# EAGLE schematic MainLogger (EAGLE 9.6.2)

## Sheet 1 of 6
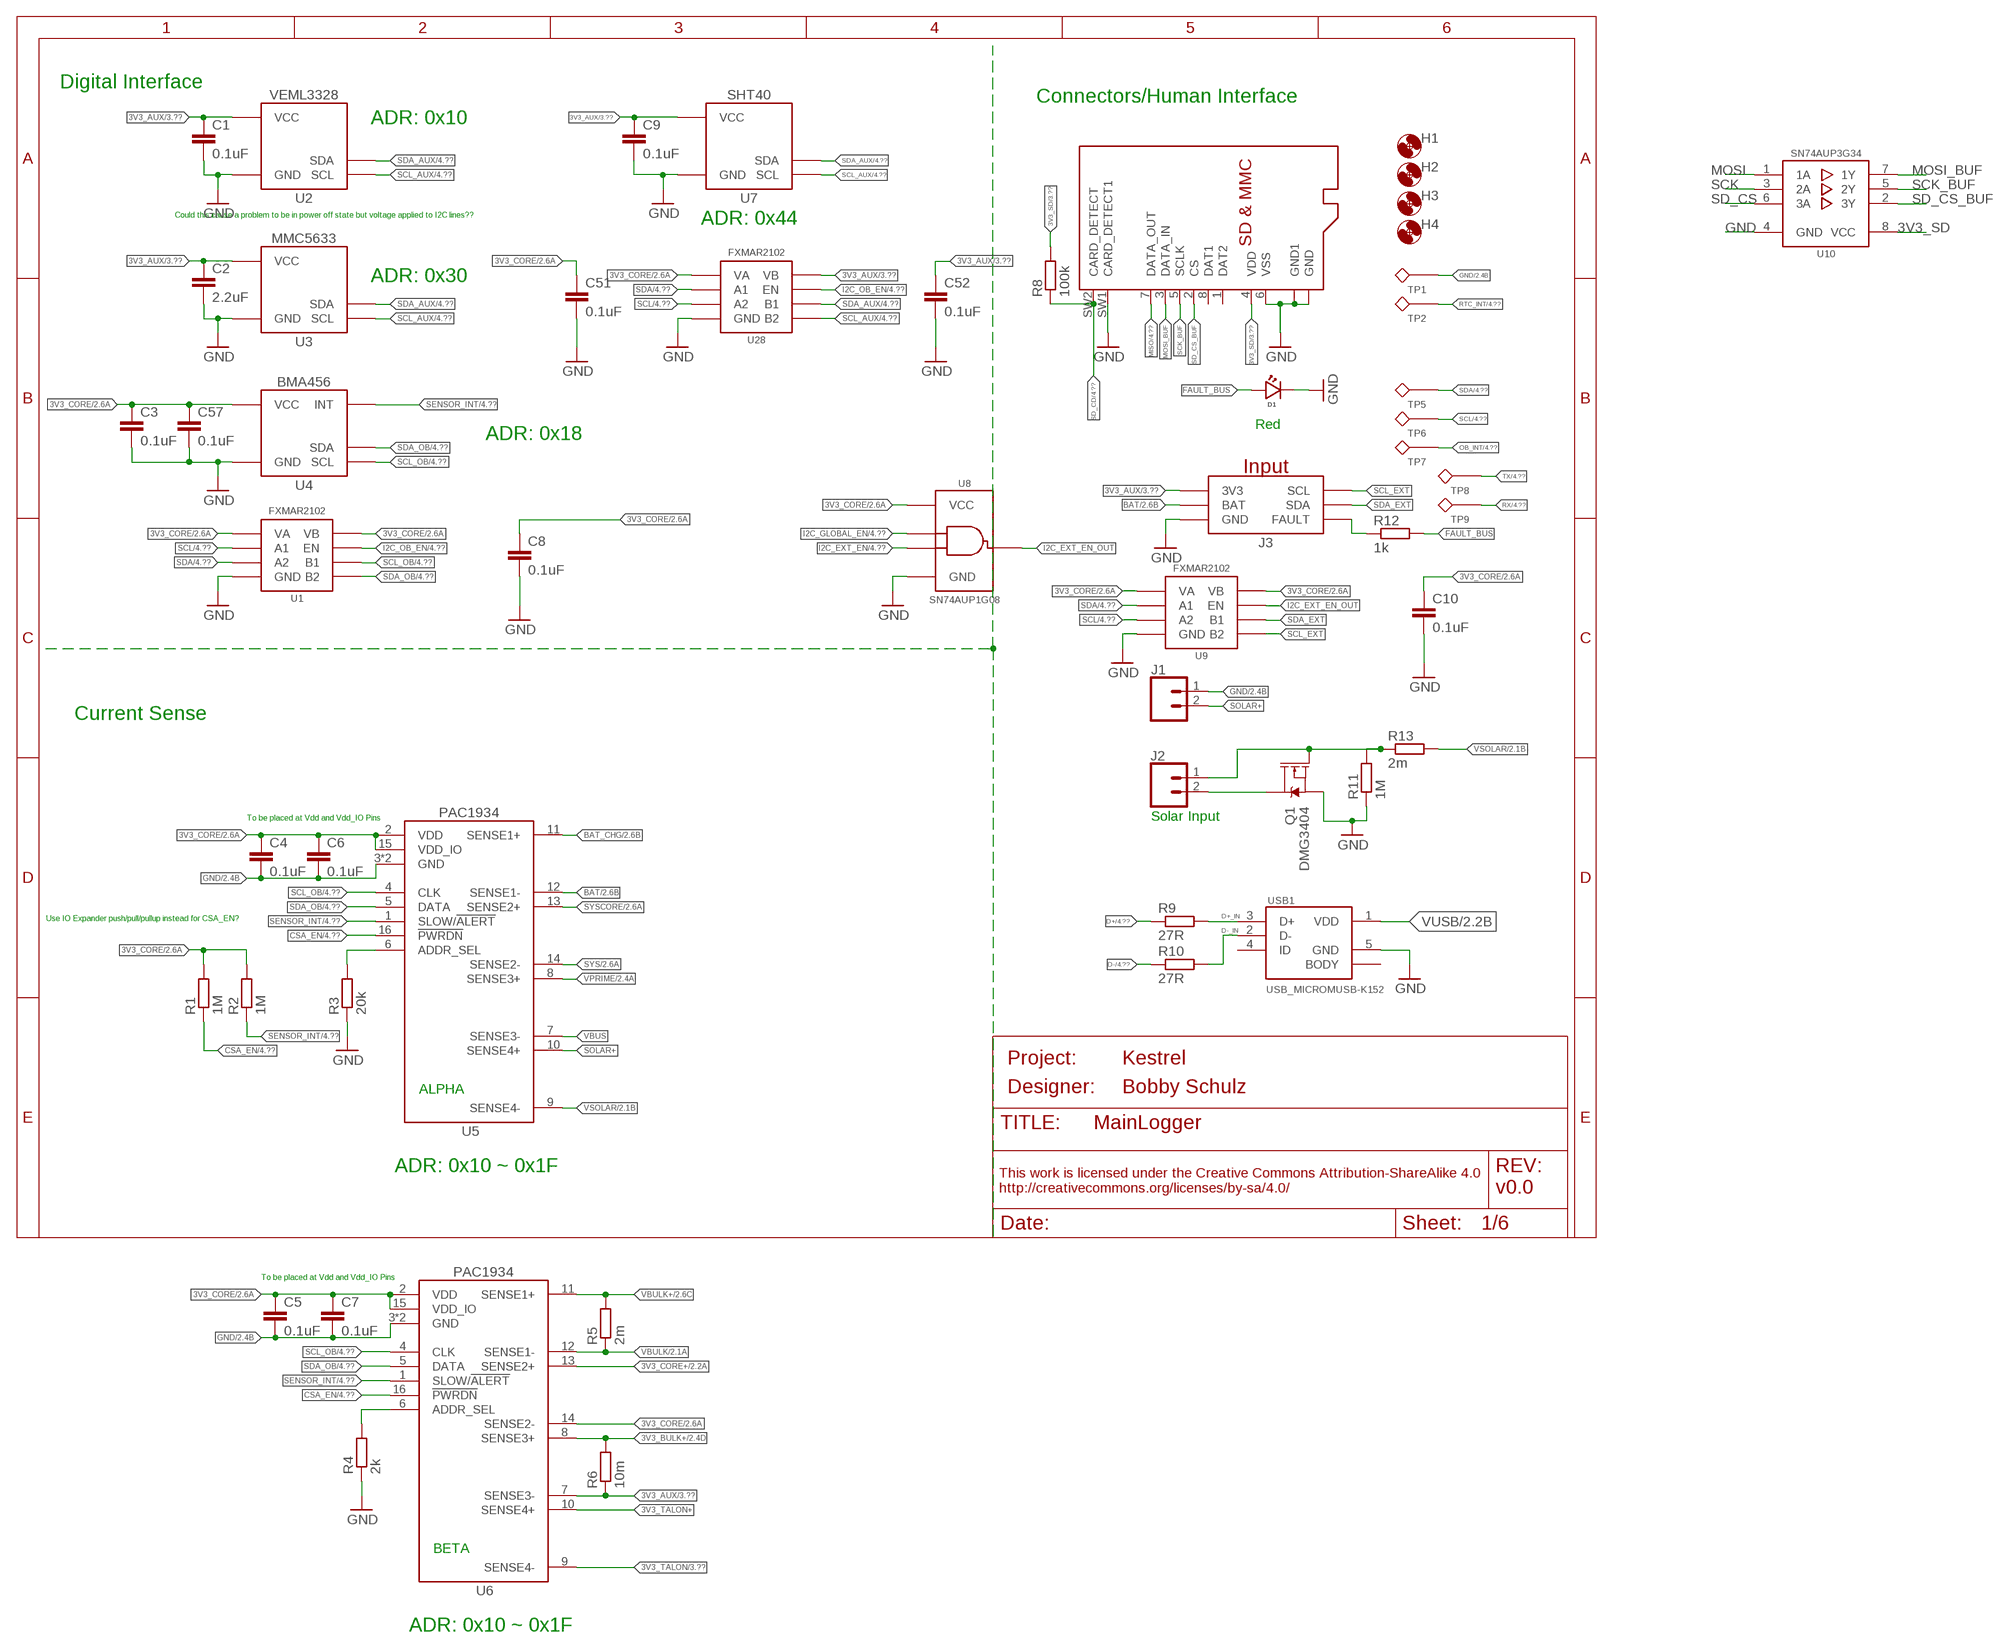
[diagram p0: schematic, sheet 1]
FRAME1 (FRAME_A_L): DESIGNER: Bobby Schulz; PROJECT: Kestrel; REV: v0.0

### Parts
C1  0.1uF  C-EU0.1UFC0402  [C0402]
C2  2.2uF  C-EU2.2UFC0603  [C0603]
C3  0.1uF  C-EU0.1UFC0402  [C0402]
C4  0.1uF  C-EU0.1UFC0402  [C0402]
C5  0.1uF  C-EU0.1UFC0402  [C0402]
C6  0.1uF  C-EU0.1UFC0402  [C0402]
C7  0.1uF  C-EU0.1UFC0402  [C0402]
C8  0.1uF  C-EU0.1UFC0402  [C0402]
C9  0.1uF  C-EU0.1UFC0402  [C0402]
C10  0.1uF  C-EU0.1UFC0402  [C0402]
C51  0.1uF  C-EU0.1UFC0402  [C0402]
C52  0.1uF  C-EU0.1UFC0402  [C0402]
C57  0.1uF  C-EU0.1UFC0402  [C0402]
D1  LEDRED0603  [LED_0603]
H1  MOUNTING_HOLE4_NP  [4_40]
H2  MOUNTING_HOLE4_NP  [4_40]
H3  MOUNTING_HOLE4_NP  [4_40]
H4  MOUNTING_HOLE4_NP  [4_40]
J1  CONN_02-JST-2MM-SMT  [JST-2-SMD]
J2  CONN_023.5MM_ROUND_RESTRICT  [SCREWTERMINAL-3.5MM-2_ROUND_RESTRICT]
J3  GEMS_POWER_PLUGINPUT_RT  [2X3_MICROFIT_RT]
Q1  DMG3404  MOSFET-NCH-DMG3404L  [SOT23-3]
R1  1M  R-EU_1MR0402  [R0402]
R2  1M  R-EU_1MR0402  [R0402]
R3  20k  R-EU_20KR0402  [R0402]
R4  2k  R-EU_2KR0402  [R0402]
R5  2m  R-EU_0.002R0805  [R0805]
R6  10m  R-EU_0.01R0805  [R0805]
R8  100k  R-EU_100KR0402  [R0402]
R9  27R  R-EU_27R0402  [R0402]
R10  27R  R-EU_27R0402  [R0402]
R11  1M  R-EU_1MR0402  [R0402]
R12  1k  R-EU_1KR0402  [R0402]
R13  2m  R-EU_0.002R0805  [R0805]
SD1  MICROSDMOLEX_503182  [MICROSD_MOLEX_5031821852]
TP1  TESTPOINT_DNP_RCU  [TESTPOINT_0603]
TP2  TESTPOINT_DNP_RCU  [TESTPOINT_0603]
TP5  TESTPOINT_DNP_RCU  [TESTPOINT_0603]
TP6  TESTPOINT_DNP_RCU  [TESTPOINT_0603]
TP7  TESTPOINT_DNP_RCU  [TESTPOINT_0603]
TP8  TESTPOINT_DNP_RCU  [TESTPOINT_0603]
TP9  TESTPOINT_DNP_RCU  [TESTPOINT_0603]
U1  FXMAR2102UMLP  [UQFN-8_1.4X1.2]
U2  VEML3328  [VEML6075]
U3  MMC5633  [BGA_4]
U4  BMA456  [LGA-12_2X2]
U5  PAC1934QFN  [QFN16]
U6  PAC1934QFN  [QFN16]
U7  SHT40  [SHT4X]
U8  SN74AUP1G08DCK  [DCK_R-PDSO-G5]
U9  FXMAR2102UMLP  [UQFN-8_1.4X1.2]
U10  SN74AUP3G34DCU  [DCU_(R-PDSO-G8)]
U28  FXMAR2102UMLP  [UQFN-8_1.4X1.2]
USB1  USB_MICROMUSB-K152  [MUSB-K152-30]

### Nets
3V3_AUX [Dummy]: C1.1 C2.1 C9.1 C52.1 J3.5(3V3) R6.1 U2.4(VCC) U3.B1(VCC) U6.7(SENSE3-) U7.3(VCC) U28.8(VB) ; also sheet 3,4
3V3_BULK+: R6.2 U6.8(SENSE3+) ; also sheet 2,3
3V3_CORE: C3.1 C4.1 C5.1 C6.1 C7.1 C8.1 C10.1 C51.1 C57.1 R1.2 R2.2 U1.1(VA) U1.8(VB) U4.3(VCC) U4.7(VCC) U4.10(VCC) U5.2(VDD) U5.15(VDD_IO) U6.2(VDD) U6.14(SENSE2-) U6.15(VDD_IO) U8.5(VCC) U9.1(VA) U9.8(VB) U28.1(VA) ; also sheet 2,3,4,5
3V3_CORE+: U6.13(SENSE2+) ; also sheet 2
3V3_SD: R8.2 SD1.4(VDD) U10.8(VCC) ; also sheet 3
3V3_TALON: U6.9(SENSE4-) ; also sheet 3,6
3V3_TALON+: U6.10(SENSE4+) ; also sheet 3
BAT: J3.1(BAT) U5.12(SENSE1-) ; also sheet 2
BAT_CHG: U5.11(SENSE1+) ; also sheet 2
CSA_EN: R1.1 U5.16(!PWRDN) U6.16(!PWRDN) ; also sheet 4
D+: R9.1 ; also sheet 4
D+_IN: R9.2 USB1.3(D+) ; also sheet 3
D-: R10.1 ; also sheet 4
D-_IN: R10.2 USB1.2(D-) ; also sheet 3
FAULT_BUS: D1.ANODE R12.2
GND: C1.2 C2.2 C3.2 C4.2 C5.2 C6.2 C7.2 C8.2 C9.2 C10.2 C51.2 C52.2 C57.2 D1.CATHODE J1.1 J3.2(GND) Q1.2(S) R3.1 R4.1 R11.1 SD1.6(VSS) SD1.BODY@1(GND1) SD1.BODY@2(GND1) SD1.BODY@3(GND) SD1.BODY@4(GND) SD1.BODY@5(GND1) SD1.SW1(CARD_DETECT1) TP1.1 U1.4(GND) U2.1(GND) U3.A1(GND) U4.1(GND) U4.8(GND) U4.9(GND) U5.3(GND) U5.EP(GND) U6.3(GND) U6.EP(GND) U7.4(GND) U8.3(GND) U9.4(GND) U10.4(GND) U28.4(GND) USB1.5(GND) ; also sheet 2,3,4,5,6
I2C_EXT_EN: U8.2(B) ; also sheet 4
I2C_EXT_EN_OUT: U8.4(Y) U9.5(EN)
I2C_GLOBAL_EN: U8.1(A) ; also sheet 4,6
I2C_OB_EN: U1.5(EN) U28.5(EN) ; also sheet 4
MISO: SD1.7(DATA_OUT) ; also sheet 4
MOSI: U10.1(1A) ; also sheet 4
MOSI_BUF: SD1.3(DATA_IN) U10.7(1Y)
N$1: R3.2 U5.6(ADDR_SEL)
N$17: R4.2 U6.6(ADDR_SEL)
N$25: J3.3(FAULT) R12.1
OB_INT: TP7.1 ; also sheet 4
RTC_INT: TP2.1 ; also sheet 4
RX: TP9.1 ; also sheet 4,6
SCK: U10.3(2A) ; also sheet 4
SCK_BUF: SD1.5(SCLK) U10.5(2Y)
SCL: TP6.1 U1.2(A1) U9.3(A2) U28.3(A2) ; also sheet 4,6
SCL_AUX: U2.3(SCL) U3.A2(SCL) U7.2(SCL) U28.6(B2) ; also sheet 4
SCL_EXT: J3.6(SCL) U9.6(B2)
SCL_OB: U1.7(B1) U4.12(SCL) U5.4(CLK) U6.4(CLK) ; also sheet 4,5
SD_CD: R8.1 SD1.SW2(CARD_DETECT) ; also sheet 4
SD_CS: U10.6(3A) ; also sheet 4
SD_CS_BUF: SD1.2(CS) U10.2(3Y)
SDA: TP5.1 U1.3(A2) U9.2(A1) U28.2(A1) ; also sheet 4,6
SDA_AUX: U2.2(SDA) U3.B2(SDA) U7.1(SDA) U28.7(B1) ; also sheet 4
SDA_EXT: J3.4(SDA) U9.7(B1)
SDA_OB: U1.6(B2) U4.2(SDA) U5.5(DATA) U6.5(DATA) ; also sheet 4,5
SENSOR_INT: R2.1 U4.5(INT) U5.1(SLOW/!ALERT) U6.1(SLOW/!ALERT) ; also sheet 4
SOLAR+: J1.2 J2.1 Q1.1(G) R11.2 R13.1 U5.10(SENSE4+)
SOLAR-: J2.2 Q1.3(D)
SYS: U5.14(SENSE2-) ; also sheet 2
SYSCORE: U5.13(SENSE2+) ; also sheet 2,4
TX: TP8.1 ; also sheet 4,6
VBULK: R5.1 U6.12(SENSE1-) ; also sheet 2,4
VBULK+: R5.2 U6.11(SENSE1+) ; also sheet 2
VBUS: U5.7(SENSE3-) ; also sheet 2
VPRIME: U5.8(SENSE3+) ; also sheet 2
VSOLAR: R13.2 U5.9(SENSE4-) ; also sheet 2
VUSB: USB1.1(VDD) ; also sheet 2,3,4
Unconnected: SD1.1(DAT2) SD1.8(DAT1) USB1.4(ID) USB1.BODY@1(BODY) USB1.BODY@2(BODY) USB1.BODY@3(BODY) USB1.BODY@4(BODY)

### Notes on the sheet
- Digital Interface
- Connectors/Human Interface
- ADR: 0x10
- Could this cause a problem to be in power off state but voltage applied to I2C lines?? | ADR: 0x44
- ADR: 0x30
- Red
- ADR: 0x18
- Current Sense
- To be placed at Vdd and Vdd_IO Pins | Solar Input
- Use IO Expander push/pull/pullup instead for CSA_EN?
- ALPHA
- ADR: 0x10 ~ 0x1F
- To be placed at Vdd and Vdd_IO Pins
- BETA
- ADR: 0x10 ~ 0x1F

## Sheet 2 of 6
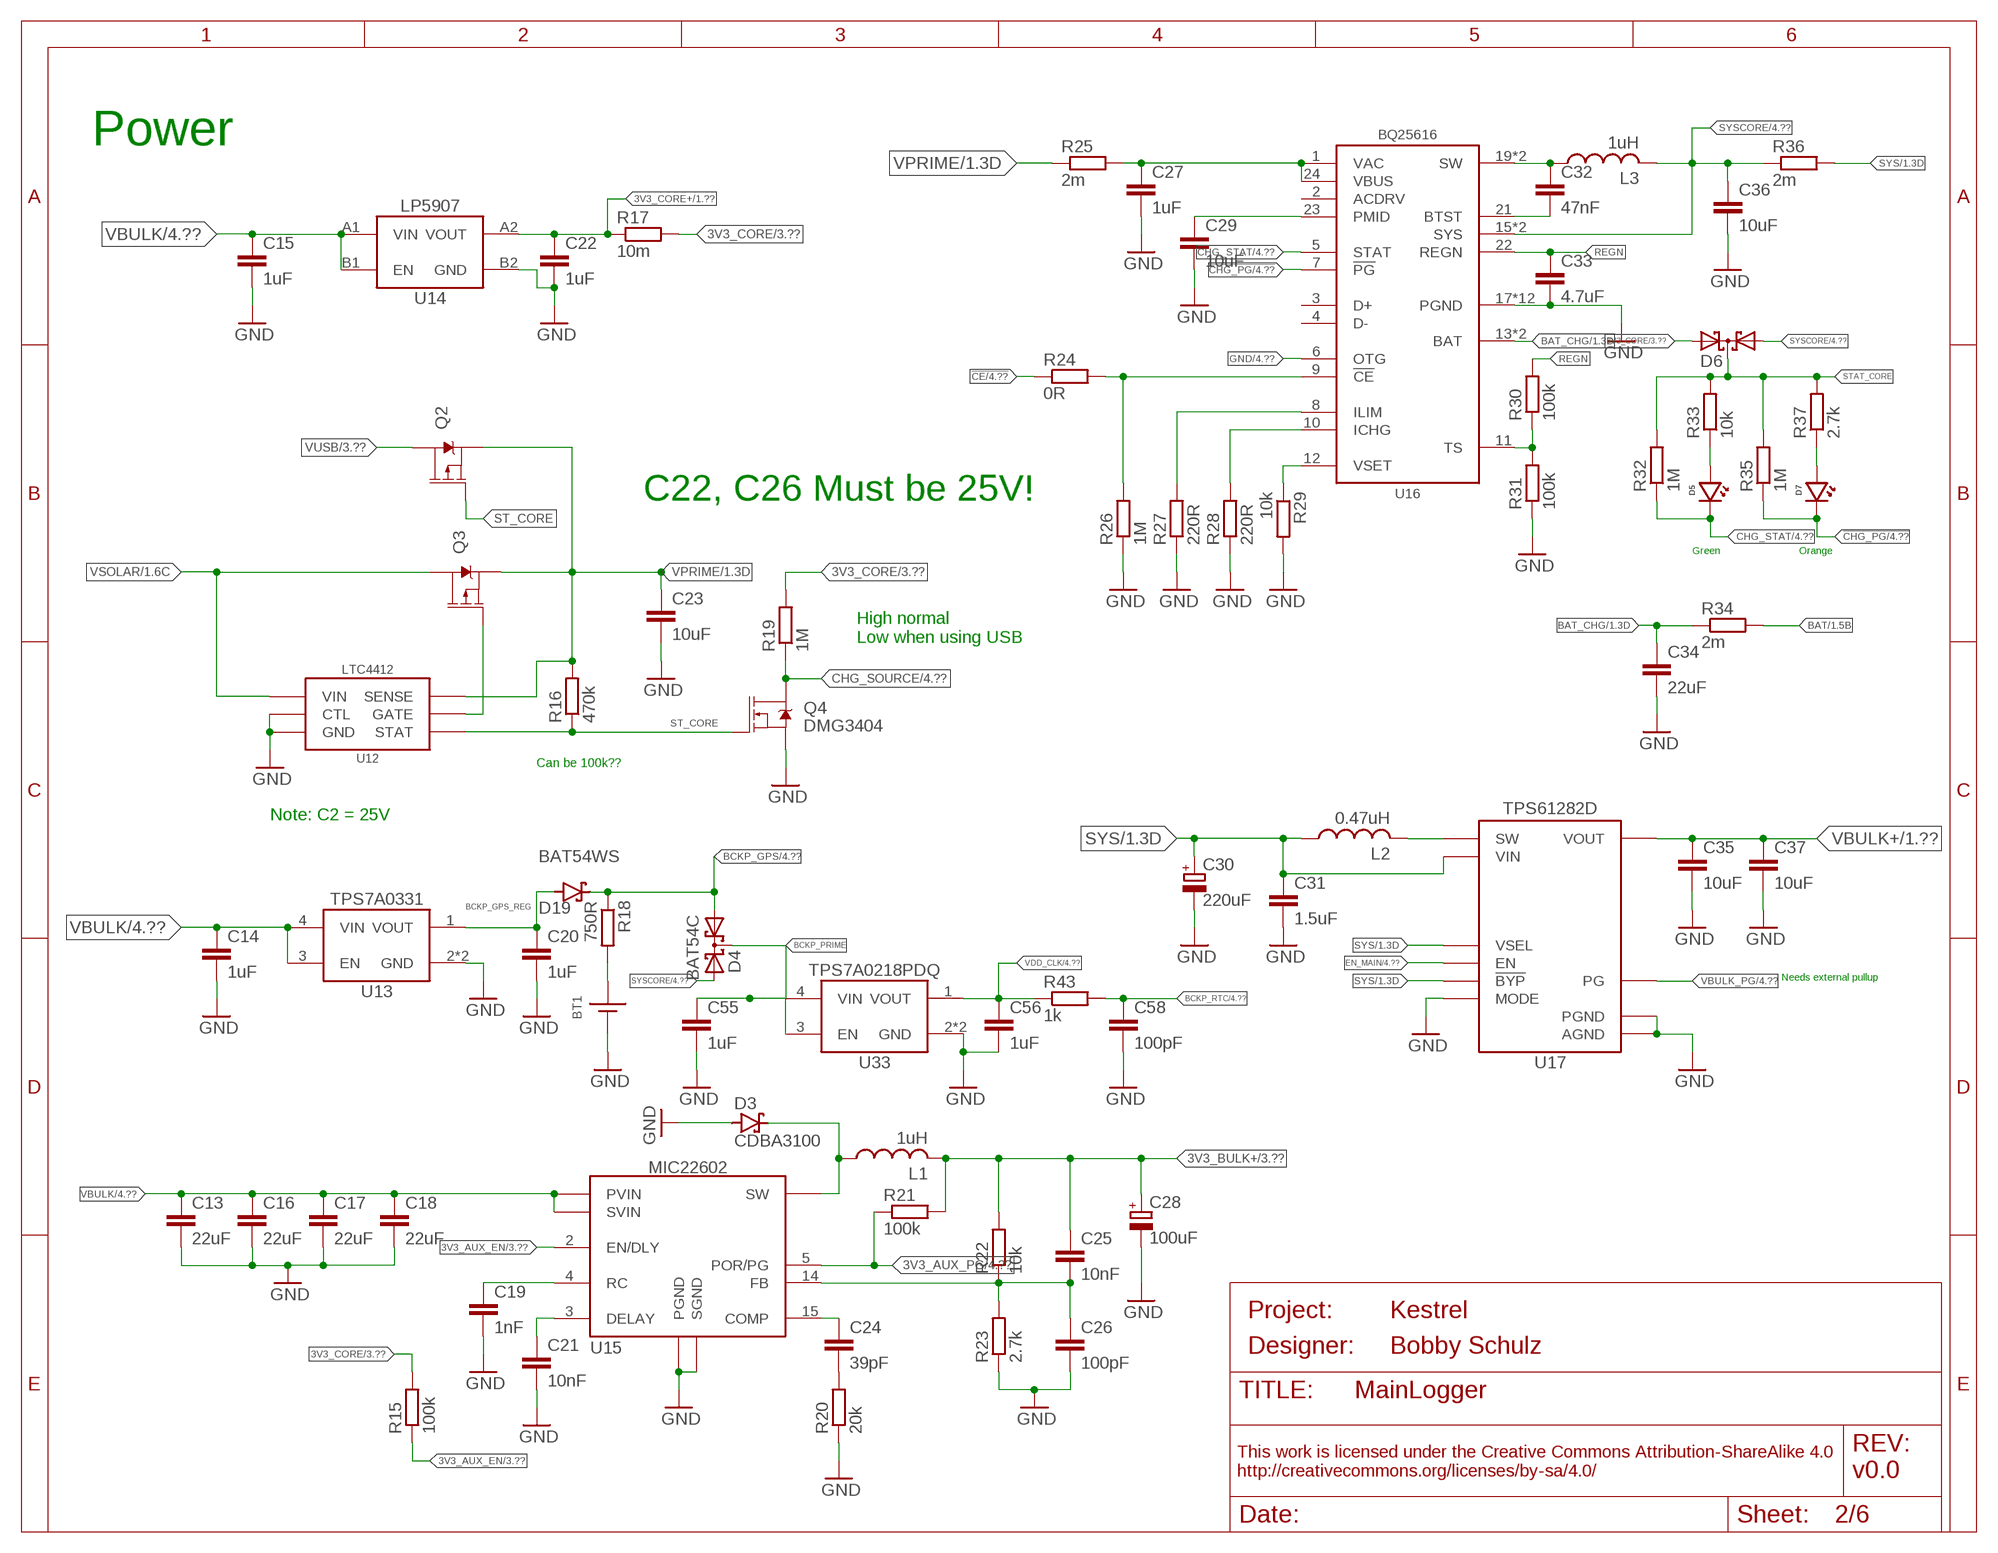
[diagram p1: schematic, sheet 2]
FRAME2 (FRAME_A_L): DESIGNER: Bobby Schulz; PROJECT: Kestrel; REV: v0.0

### Parts
BT1  BATTERY_COINML621  [ML621S]
C13  22uF  C-EU22UFC0805  [C0805]
C14  1uF  C-EU1UFC0603  [C0603]
C15  1uF  C-EU1UFC0603  [C0603]
C16  22uF  C-EU22UFC0805  [C0805]
C17  22uF  C-EU22UFC0805  [C0805]
C18  22uF  C-EU22UFC0805  [C0805]
C19  1nF  C-EU1NFC0402  [C0402]
C20  1uF  C-EU1UFC0603  [C0603]
C21  10nF  C-EU10NFC0402  [C0402]
C22  1uF  C-EU1UFC0603  [C0603]
C23  10uF  C-EU10UFC0805  [C0805]
C24  39pF  C-EU39PFC0402  [C0402]
C25  10nF  C-EU10NFC0402  [C0402]
C26  100pF  C-EU100PFC0402  [C0402]
C27  1uF  C-EU1UFC0603  [C0603]
C28  100uF  CTANT_EU1411  [C1411_TANT]
C29  10uF  C-EU10UFC0805  [C0805]
C30  220uF  CTANT_EU2917  [C2917]
C31  1.5uF  C-EU1.5UFC0805  [C0805]
C32  47nF  C-EU47NFC0402  [C0402]
C33  4.7uF  C-EU4.7UFC0805  [C0805]
C34  22uF  C-EU22UFC0805  [C0805]
C35  10uF  C-EU10UFC0805  [C0805]
C36  10uF  C-EU10UFC0805  [C0805]
C37  10uF  C-EU10UFC0805  [C0805]
C55  1uF  C-EU1UFC0603  [C0603]
C56  1uF  C-EU1UFC0603  [C0603]
C58  100pF  C-EU100PFC0402  [C0402]
D3  CDBA3100  DIODE_SCHOTTKYDO-214AC  [DO214AC]
D4  BAT54C  DIODE_CCBAT54CSOT23  [SOT23-3]
D5  LEDGREEN0603  [LED_0603]
D6  DIODE_CCBAT54CSOT23  [SOT23-3]
D7  LEDYELLOW0603  [LED_0603]
D19  BAT54WS  DIODE_SCHOTTKYSOD-323  [SOD323-R]
L1  1uH  INDUCTOR_MAIA_4.1X4.1  [WE-MAIA(4.1X4.1)]
L2  0.47uH  INDUCTOR_MAPI_4.1X4.1  [WE-MAPI(4.1X4.1)]
L3  1uH  INDUCTOR_MAIA_4.1X4.1  [WE-MAIA(4.1X4.1)]
Q2  MOSFET_PCH-DMP3036SFG  [POWERDI3333-8]
Q3  MOSFET_PCH-DMP3036SFG  [POWERDI3333-8]
Q4  DMG3404  MOSFET-NCH-DMG3404L  [SOT23-3]
R15  100k  R-EU_100KR0402  [R0402]
R16  470k  R-EU_470KR0603  [R0603]
R17  10m  R-EU_0.01R0805  [R0805]
R18  750R  R-EU_750R0603  [R0603]
R19  1M  R-EU_1MR0402  [R0402]
R20  20k  R-EU_20KR0402  [R0402]
R21  100k  R-EU_100KR0402  [R0402]
R22  10k  R-EU_10KR0402  [R0402]
R23  2.7k  R-EU_2.7KR0402  [R0402]
R24  0R  R-EU_0.0R0402  [R0402]
R25  2m  R-EU_0.002R0805  [R0805]
R26  1M  R-EU_1MR0402  [R0402]
R27  220R  R-EU_220R0402  [R0402]
R28  220R  R-EU_220R0402  [R0402]
R29  10k  R-EU_10KR0402  [R0402]
R30  100k  R-EU_100KR0402  [R0402]
R31  100k  R-EU_100KR0402  [R0402]
R32  1M  R-EU_1MR0402  [R0402]
R33  10k  R-EU_10KR0402  [R0402]
R34  2m  R-EU_0.002R0805  [R0805]
R35  1M  R-EU_1MR0402  [R0402]
R36  2m  R-EU_0.002R0805  [R0805]
R37  2.7k  R-EU_2.7KR0402  [R0402]
R43  1k  R-EU_1KR0402  [R0402]
U12  LTC4412S6  [SOT23-6L]
U13  TPS7A0331PDQ  [X2SON]
U14  LP59073.3VYKE  [YKE0004]
U15  MIC22602  [QFN24_POWER]
U16  BQ25616  [QFN24_POWER]
U17  TPS61282D  [YFP0016]
U33  TPS7A0218PDQ  [X2SON]

### Nets
3V3_AUX_EN: R15.1 U15.2(EN/DLY) ; also sheet 3,4
3V3_AUX_PG: R21.1 U15.5(POR/PG) ; also sheet 4
3V3_BULK+: C25.1 C28.ANODE(+) L1.P$2 R21.2 R22.2 ; also sheet 1,3
3V3_CORE: D6.2(A2) R15.2 R17.2 R19.2 ; also sheet 1,3,4,5
3V3_CORE+: C22.1 R17.1 U14.A2(VOUT) ; also sheet 1
!CE: R24.1 ; also sheet 4
!CHG_PG: D7.CATHODE R35.1 U16.7(!PG) ; also sheet 4
BAT: R34.2 ; also sheet 1
BAT_CHG: C34.1 R34.1 U16.13(BAT) U16.14(BAT) ; also sheet 1
BCKP_GPS: D4.1(A1) D19.C R18.1 ; also sheet 4
BCKP_GPS_REG: C20.1 D19.A U13.1(VOUT)
BCKP_PRIME: C55.1 D4.3(C) U33.3(EN) U33.4(VIN)
BCKP_RTC: C58.1 R43.2 ; also sheet 4
BTST: C32.2 U16.21(BTST)
CHG_SOURCE: Q4.3(D) R19.1 ; also sheet 4
CHG_STAT: D5.CATHODE R32.1 U16.5(STAT) ; also sheet 4
COMP: C24.1 U15.15(COMP)
DELAY: C21.1 U15.3(DELAY)
EN_MAIN: U17.A1(EN) ; also sheet 4
FB: C25.2 C26.1 R22.1 R23.2 U15.14(FB)
GND: BT1.- C13.2 C14.2 C15.2 C16.2 C17.2 C18.2 C19.2 C20.2 C21.2 C22.2 C23.2 C26.2 C27.2 C28.CATHODE(-) C29.2 C30.- C31.2 C33.2 C34.2 C35.2 C36.2 C37.2 C55.2 C56.2 C58.2 D3.A Q4.2(S) R20.1 R23.1 R26.1 R27.1 R28.1 R29.2 R31.1 U12.2(GND) U12.3(CTL) U13.2(GND) U13.EP(GND) U14.B2(GND) U15.7(PGND) U15.12(PGND) U15.16(SGND) U15.19(PGND) U15.24(PGND) U15.EP(PGND) U15.EP@1(PGND) U15.EP@2(PGND) U15.EP@3(PGND) U15.EP@4(PGND) U15.EP@5(PGND) U15.EP@6(PGND) U15.EP@7(PGND) U15.EP@8(PGND) U15.EP@9(PGND) U16.6(OTG) U16.17(PGND) U16.18(PGND) U16.EP(PGND) U16.EP@1(PGND) U16.EP@2(PGND) U16.EP@3(PGND) U16.EP@4(PGND) U16.EP@5(PGND) U16.EP@6(PGND) U16.EP@7(PGND) U16.EP@8(PGND) U16.EP@9(PGND) U17.B2(MODE) U17.C2(AGND) U17.D1(AGND) U17.D2(PGND) U17.D3(PGND) U17.D4(PGND) U33.2(GND) U33.EP(GND) ; also sheet 1,3,4,5,6
ICHG: R28.2 U16.10(ICHG)
ILIM: R27.2 U16.8(ILIM)
N$5: Q3.4(G) U12.5(GATE)
N$7: BT1.+ R18.2
N$10: R24.2 R26.2 U16.9(!CE)
N$18: D7.ANODE R37.1
N$20: D5.ANODE R33.1
N$33: C24.2 R20.2
PMID: C29.1 U16.23(PMID)
RC: C19.1 U15.4(RC)
REGN: C33.1 R30.2 U16.22(REGN)
ST_CORE: Q2.4(G) Q4.1(G) R16.1 U12.4(STAT)
STAT_CORE: D6.3(C) R32.2 R33.2 R35.2 R37.2
SW: C32.1 L3.P$1 U16.19(SW) U16.20(SW)
SW1: D3.C L1.P$1 U15.8(SW) U15.9(SW) U15.10(SW) U15.11(SW) U15.20(SW) U15.21(SW) U15.22(SW) U15.23(SW)
SW2: L2.P$2 U17.C3(SW) U17.C4(SW)
SYS: C30.+ C31.1 L2.P$1 R36.2 U17.A3(VIN) U17.A4(VIN) U17.B1(VSEL) U17.C1(!BYP) ; also sheet 1
SYSCORE: C36.1 D4.2(A2) D6.1(A1) L3.P$2 R36.1 U16.15(SYS) U16.16(SYS) ; also sheet 1,4
TS: R30.1 R31.2 U16.11(TS)
VBULK: C13.1 C14.1 C15.1 C16.1 C17.1 C18.1 U13.3(EN) U13.4(VIN) U14.A1(VIN) U14.B1(EN) U15.1(PVIN) U15.6(PVIN) U15.13(PVIN) U15.17(SVIN) U15.18(PVIN) ; also sheet 1,4
VBULK+: C35.1 C37.1 U17.B3(VOUT) U17.B4(VOUT) ; also sheet 1
VBULK_PG: U17.A2(PG) ; also sheet 4
VBUS: C27.1 R25.2 U16.1(VAC) U16.24(VBUS) ; also sheet 1
VDD_CLK: C56.1 R43.1 U33.1(VOUT) ; also sheet 4
VPRIME: C23.1 Q2.1(S) Q2.2(S) Q2.3(S) Q3.1(S) Q3.2(S) Q3.3(S) R16.2 R25.1 U12.6(SENSE) ; also sheet 1
VSET: R29.1 U16.12(VSET)
VSOLAR: Q3.EP@1(D) Q3.EP@2(D) Q3.EP@3(D) Q3.EP@4(D) Q3.EP@5(D) U12.1(VIN) ; also sheet 1
VUSB: Q2.EP@1(D) Q2.EP@2(D) Q2.EP@3(D) Q2.EP@4(D) Q2.EP@5(D) ; also sheet 1,3,4
Unconnected: U16.2(ACDRV) U16.3(D+) U16.4(D-)

### Notes on the sheet
- Power
- C22, C26 Must be 25V!
- Green | Orange
- High normal
  Low when using USB
- Can be 100k??
- Note: C2 = 25V
- Needs external pullup

## Sheet 3 of 6
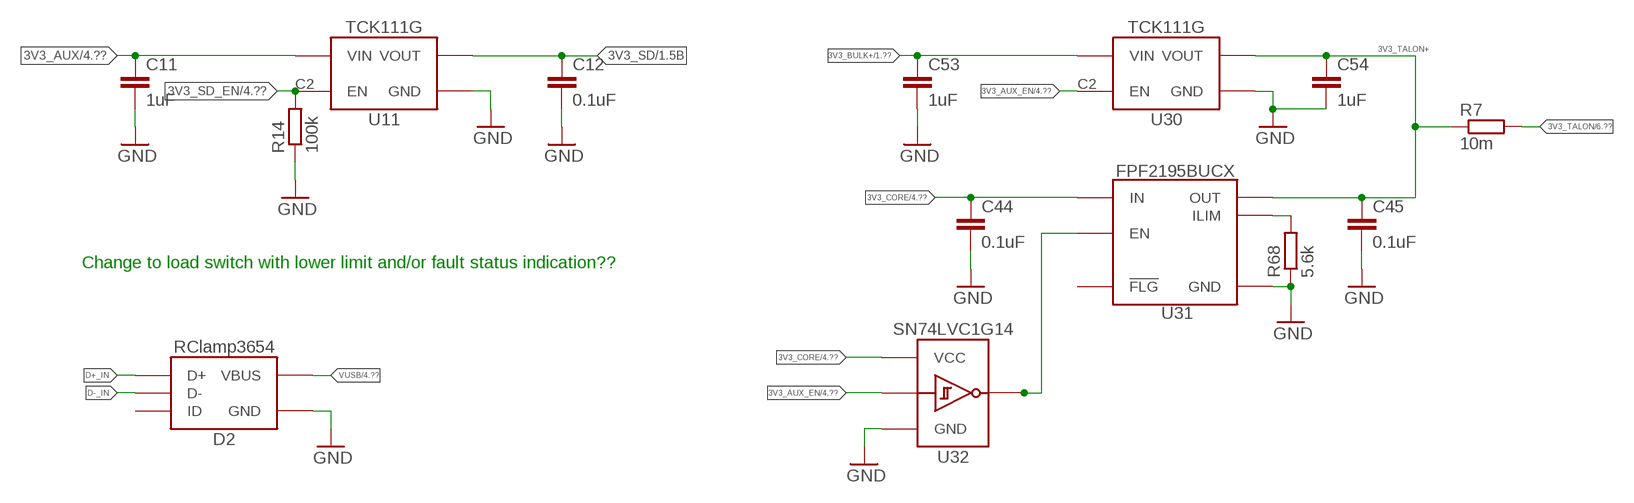
[diagram p2: schematic, sheet 3]

### Parts
C11  1uF  C-EU1UFC0603  [C0603]
C12  0.1uF  C-EU0.1UFC0402  [C0402]
C44  0.1uF  C-EU0.1UFC0402  [C0402]
C45  0.1uF  C-EU0.1UFC0402  [C0402]
C53  1uF  C-EU1UFC0603  [C0603]
C54  1uF  C-EU1UFC0603  [C0603]
D2  RCLAMP3654  [DFN_6_1.6X1.6]
R7  10m  R-EU_0.01R0805  [R0805]
R14  100k  R-EU_100KR0402  [R0402]
R68  5.6k  R-EU_5.6KR0402  [R0402]
U11  TCK111G  [WCSP_6]
U30  TCK111G  [WCSP_6]
U31  FPF2195BUCX  [WCSP_6]
U32  SN74LVC1G14DCK  [DCK_R-PDSO-G5]

### Nets
3V3_AUX [Dummy]: C11.1 U11.A2(VIN) U11.B2(VIN) ; also sheet 1,4
3V3_AUX_EN: U30.C2(EN) U32.2(A) ; also sheet 2,4
3V3_BULK+: C53.1 U30.A2(VIN) U30.B2(VIN) ; also sheet 1,2
3V3_CORE: C44.1 U31.B2(IN) U32.5(VCC) ; also sheet 1,2,4,5
3V3_SD: C12.1 U11.A1(VOUT) U11.B1(VOUT) ; also sheet 1
3V3_SD_EN: R14.2 U11.C2(EN) ; also sheet 4
3V3_TALON: R7.2 ; also sheet 1,6
3V3_TALON+: C45.1 C54.1 R7.1 U30.A1(VOUT) U30.B1(VOUT) U31.B1(OUT) ; also sheet 1
D+_IN: D2.2(D+) ; also sheet 1
D-_IN: D2.1(D-) ; also sheet 1
GND: C11.2 C12.2 C44.2 C45.2 C53.2 C54.2 D2.EP(GND) R14.1 R68.1 U11.C1(GND) U30.C1(GND) U31.C2(GND) U32.3(GND) ; also sheet 1,2,4,5,6
N$19: R68.2 U31.C1(ILIM)
N$28: U31.A2(EN) U32.4(Y)
VUSB: D2.6(VBUS) ; also sheet 1,2,4
Unconnected: D2.3(ID) U31.A1(!FLG)

### Notes on the sheet
- Change to load switch with lower limit and/or fault status indication??

## Sheet 4 of 6
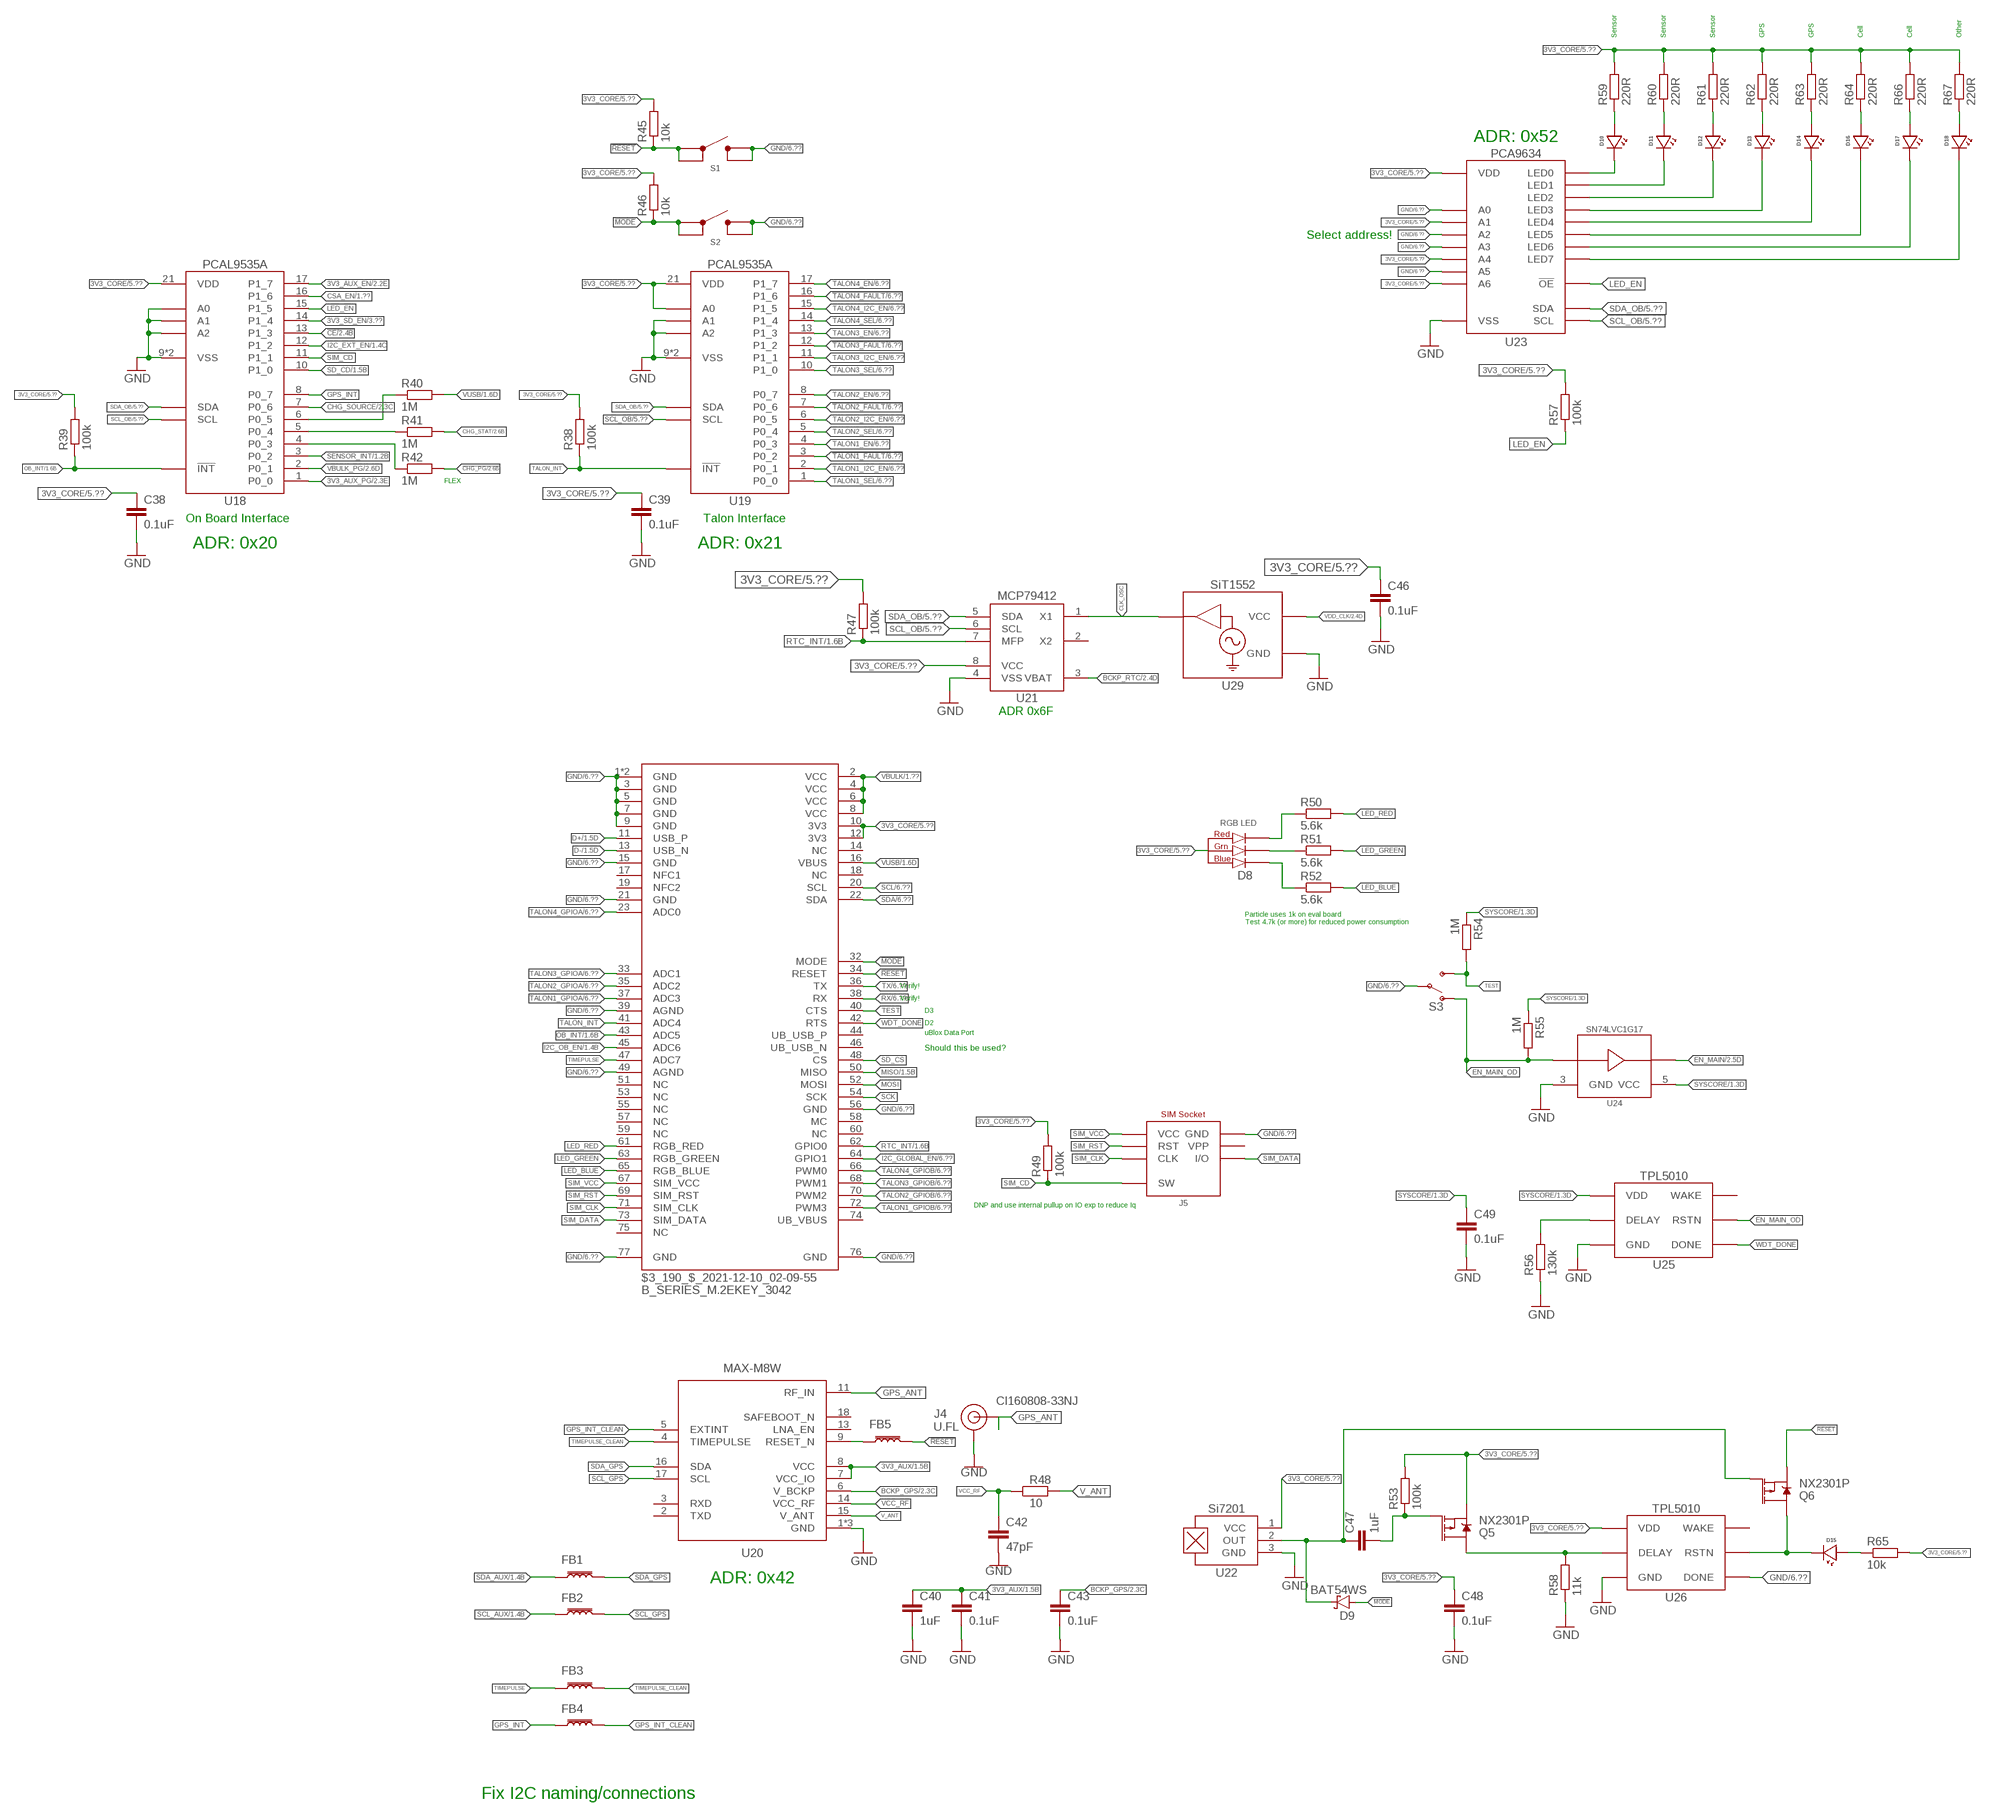
[diagram p3: schematic, sheet 4]

### Parts
$3_190_$_2021-12-10_02-09-55  B_SERIES_M.2EKEY_3042  [PARTICLE_M.2EKEY]
C38  0.1uF  C-EU0.1UFC0402  [C0402]
C39  0.1uF  C-EU0.1UFC0402  [C0402]
C40  1uF  C-EU1UFC0603  [C0603]
C41  0.1uF  C-EU0.1UFC0402  [C0402]
C42  47pF  C-EU47PFC0402  [C0402]
C43  0.1uF  C-EU0.1UFC0402  [C0402]
C46  0.1uF  C-EU0.1UFC0402  [C0402]
C47  1uF  C-EU1UFC0603  [C0603]
C48  0.1uF  C-EU0.1UFC0402  [C0402]
C49  0.1uF  C-EU0.1UFC0402  [C0402]
D8  CLVBA-FKA  [CLVBA-FKA]
D9  BAT54WS  DIODE_SCHOTTKYSOD-323  [SOD323-R]
D10  LEDGREEN0603  [LED_0603]
D11  LEDYELLOW0603  [LED_0603]
D12  LEDRED0603  [LED_0603]
D13  LEDGREEN0603  [LED_0603]
D14  LEDYELLOW0603  [LED_0603]
D15  LEDGREEN0603  [LED_0603]
D16  LEDGREEN0603  [LED_0603]
D17  LEDYELLOW0603  [LED_0603]
D18  LEDRED0603  [LED_0603]
FB1  FERRITE_BEAD1KS0402  [R0402]
FB2  FERRITE_BEAD1KS0402  [R0402]
FB3  FERRITE_BEAD1KS0402  [R0402]
FB4  FERRITE_BEAD1KS0402  [R0402]
FB5  FERRITE_BEAD1KS0402  [R0402]
J4  U.FL  U.FL2PIN  [U.FL]
J5  SIM_CDNANO_SF72  [SIM_SF72]
Q5  NX2301P  MOSFET-PCH-NX2301P  [SOT23-3]
Q6  NX2301P  MOSFET-PCH-NX2301P  [SOT23-3]
R38  100k  R-EU_100KR0402  [R0402]
R39  100k  R-EU_100KR0402  [R0402]
R40  1M  R-EU_1MR0402  [R0402]
R41  1M  R-EU_1MR0402  [R0402]
R42  1M  R-EU_1MR0402  [R0402]
R45  10k  R-EU_10KR0402  [R0402]
R46  10k  R-EU_10KR0402  [R0402]
R47  100k  R-EU_100KR0402  [R0402]
R48  10  R-EU_10R0402  [R0402]
R49  100k  R-EU_100KR0402  [R0402]
R50  5.6k  R-EU_5.6KR0402  [R0402]
R51  5.6k  R-EU_5.6KR0402  [R0402]
R52  5.6k  R-EU_5.6KR0402  [R0402]
R53  100k  R-EU_100KR0402  [R0402]
R54  1M  R-EU_1MR0402  [R0402]
R55  1M  R-EU_1MR0402  [R0402]
R56  130k  R-EU_130KR0402  [R0402]
R57  100k  R-EU_100KR0402  [R0402]
R58  11k  R-EU_11KR0402  [R0402]
R59  220R  R-EU_220R0402  [R0402]
R60  220R  R-EU_220R0402  [R0402]
R61  220R  R-EU_220R0402  [R0402]
R62  220R  R-EU_220R0402  [R0402]
R63  220R  R-EU_220R0402  [R0402]
R64  220R  R-EU_220R0402  [R0402]
R65  10k  R-EU_10KR0402  [R0402]
R66  220R  R-EU_220R0402  [R0402]
R67  220R  R-EU_220R0402  [R0402]
S1  BUTTON4.2X3.2  [SWITCH_4.2X3.2]
S2  BUTTON4.2X3.2  [SWITCH_4.2X3.2]
S3  SPDT7103K2CWAV2  [7103K2CWAV2]
U18  PCAL9535AQFN  [QFN24]
U19  PCAL9535AQFN  [QFN24]
U20  MAX-M8W  [MAX-M8]
U21  MCP79412SOIC  [SO08]
U22  HALL_EFFECT_SI7201  [SOT23-3]
U23  PCA9634QFN  [QFN20_5X5]
U24  SN74LVC1G17DCK  [DCK_R-PDSO-G5]
U25  TPL5010DDC  [DDC_R-PDSO-G6]
U26  TPL5010DDC  [DDC_R-PDSO-G6]
U29  SIT1552  [LD-4]

### Nets
3V3_AUX [Dummy]: C40.1 C41.1 U20.7(VCC_IO) U20.8(VCC) ; also sheet 1,3
3V3_AUX_EN: U18.17(P1_7) ; also sheet 2,3
3V3_AUX_PG: U18.1(P0_0) ; also sheet 2
3V3_CORE: $3_190_$_2021-12-10_02-09-55.10(3V3) $3_190_$_2021-12-10_02-09-55.12(3V3) C38.1 C39.1 C46.1 C48.1 D8.2(ANODE) Q5.2(S) R38.2 R39.2 R45.2 R46.2 R47.2 R49.2 R53.2 R57.2 R59.2 R60.2 R61.2 R62.2 R63.2 R64.2 R65.2 R66.2 R67.2 U18.21(VDD) U19.18(A0) U19.21(VDD) U21.8(VCC) U22.1(VCC) U23.3(A4) U23.15(A6) U23.18(VDD) U23.20(A1) U26.1(VDD) ; also sheet 1,2,3,5
3V3_SD_EN: U18.14(P1_4) ; also sheet 3
!CE: U18.13(P1_3) ; also sheet 2
!CHG_PG: R42.2 ; also sheet 2
!MODE: $3_190_$_2021-12-10_02-09-55.32(MODE) D9.A R46.1 S2.1 S2.2
!RESET: $3_190_$_2021-12-10_02-09-55.34(RESET) FB5.2 Q6.2(S) R45.1 S1.1 S1.2
!TALON1_FAULT: U19.3(P0_2) ; also sheet 6
!TALON2_FAULT: U19.7(P0_6) ; also sheet 6
!TALON3_FAULT: U19.12(P1_2) ; also sheet 6
!TALON4_FAULT: U19.16(P1_6) ; also sheet 6
BCKP_GPS: C43.1 U20.6(V_BCKP) ; also sheet 2
BCKP_RTC: U21.3(VBAT) ; also sheet 2
CHG_SOURCE: U18.7(P0_6) ; also sheet 2
CHG_STAT: R41.2 ; also sheet 2
CLK_OSC: U21.1(X1) U29.2(CLK)
CSA_EN: U18.16(P1_6) ; also sheet 1
D+: $3_190_$_2021-12-10_02-09-55.11(USB_P) ; also sheet 1
D-: $3_190_$_2021-12-10_02-09-55.13(USB_N) ; also sheet 1
EN_MAIN: U24.4(Y) ; also sheet 2
EN_MAIN_OD: R55.2 S3.1(O) U24.2(A) U25.6(RSTN)
GND: $3_190_$_2021-12-10_02-09-55.1(GND) $3_190_$_2021-12-10_02-09-55.3(GND) $3_190_$_2021-12-10_02-09-55.5(GND) $3_190_$_2021-12-10_02-09-55.7(GND) $3_190_$_2021-12-10_02-09-55.9(GND) $3_190_$_2021-12-10_02-09-55.15(GND) $3_190_$_2021-12-10_02-09-55.21(GND) $3_190_$_2021-12-10_02-09-55.39(AGND) $3_190_$_2021-12-10_02-09-55.49(AGND) $3_190_$_2021-12-10_02-09-55.56(GND) $3_190_$_2021-12-10_02-09-55.76(GND) $3_190_$_2021-12-10_02-09-55.77(GND) $3_190_$_2021-12-10_02-09-55.GND C38.2 C39.2 C40.2 C41.2 C42.2 C43.2 C46.2 C48.2 C49.2 J4.1(GND) J4.2(GND) J5.5(GND) J5.CSW(GND) J5.GND@1(GND) J5.GND@2(GND) J5.GND@3(GND) J5.GND@4(GND) J5.GND@5(GND) J5.GND@6(GND) J5.GND@7(GND) J5.GND@8(GND) J5.GND@9(GND) J5.GND@10(GND) R56.1 R58.1 S1.3 S1.4 S2.3 S2.4 S3.2(P) U18.9(VSS) U18.18(A0) U18.23(A1) U18.24(A2) U18.EP(VSS) U19.9(VSS) U19.23(A1) U19.24(A2) U19.EP(VSS) U20.1(GND) U20.10(GND) U20.12(GND) U21.4(VSS) U22.3(GND) U23.1(A2) U23.2(A3) U23.8(VSS) U23.14(A5) U23.19(A0) U23.EP(VSS) U24.3(GND) U25.2(GND) U26.2(GND) U26.4(DONE) U29.1(GND) U29.4(GND) ; also sheet 1,2,3,5,6
GPS_ANT: J4.FEED(SIGNAL) U20.11(RF_IN)
GPS_INT: FB4.1 U18.8(P0_7)
GPS_INT_CLEAN: FB4.2 U20.5(EXTINT)
I2C_EXT_EN: U18.12(P1_2) ; also sheet 1
I2C_GLOBAL_EN: $3_190_$_2021-12-10_02-09-55.64(GPIO1) ; also sheet 1,6
I2C_OB_EN: $3_190_$_2021-12-10_02-09-55.45(ADC6) ; also sheet 1
LED_BLUE: $3_190_$_2021-12-10_02-09-55.65(RGB_BLUE) R52.2
LED_EN: R57.1 U18.15(P1_5) U23.13(!OE)
LED_GREEN: $3_190_$_2021-12-10_02-09-55.63(RGB_GREEN) R51.2
LED_RED: $3_190_$_2021-12-10_02-09-55.61(RGB_RED) R50.2
MISO: $3_190_$_2021-12-10_02-09-55.50(MISO) ; also sheet 1
MOSI: $3_190_$_2021-12-10_02-09-55.52(MOSI) ; also sheet 1
N$6: R41.1 U18.5(P0_4)
N$8: R40.1 U18.6(P0_5)
N$9: R42.1 U18.4(P0_3)
N$11: C47.1 D9.C Q6.1(G) U22.2(OUT)
N$12: D15.CATHODE Q6.3(D) U26.6(RSTN)
N$13: C47.2 Q5.1(G) R53.1
N$14: D15.ANODE R65.1
N$21: D8.3(BLUE_CATH) R52.1
N$22: D8.4(GREEN_CATH) R51.1
N$23: D8.1(RED_CATH) R50.1
N$24: FB5.1 U20.9(RESET_N)
N$30: R56.2 U25.3(DELAY)
N$32: Q5.3(D) R58.2 U26.3(DELAY)
N$36: D10.CATHODE U23.4(LED0)
N$37: D11.CATHODE U23.5(LED1)
N$39: D12.CATHODE U23.6(LED2)
N$40: D13.CATHODE U23.7(LED3)
N$41: D14.CATHODE U23.9(LED4)
N$42: D16.CATHODE U23.10(LED5)
N$43: D17.CATHODE U23.11(LED6)
N$44: D18.CATHODE U23.12(LED7)
N$45: D10.ANODE R59.1
N$46: D11.ANODE R60.1
N$47: D12.ANODE R61.1
N$48: D13.ANODE R62.1
N$49: D14.ANODE R63.1
N$50: D16.ANODE R64.1
N$51: D17.ANODE R66.1
N$52: D18.ANODE R67.1
OB_INT: $3_190_$_2021-12-10_02-09-55.43(ADC5) R39.1 U18.22(!INT) ; also sheet 1
RTC_INT: $3_190_$_2021-12-10_02-09-55.62(GPIO0) R47.1 U21.7(MFP) ; also sheet 1
RX: $3_190_$_2021-12-10_02-09-55.38(RX) ; also sheet 1,6
SCK: $3_190_$_2021-12-10_02-09-55.54(SCK) ; also sheet 1
SCL: $3_190_$_2021-12-10_02-09-55.20(SCL) ; also sheet 1,6
SCL_AUX: FB2.1 ; also sheet 1
SCL_GPS: FB2.2 U20.17(SCL)
SCL_OB: U18.19(SCL) U19.19(SCL) U21.6(SCL) U23.16(SCL) ; also sheet 1,5
SD_CD: U18.10(P1_0) ; also sheet 1
SD_CS: $3_190_$_2021-12-10_02-09-55.48(CS) ; also sheet 1
SDA: $3_190_$_2021-12-10_02-09-55.22(SDA) ; also sheet 1,6
SDA_AUX: FB1.1 ; also sheet 1
SDA_GPS: FB1.2 U20.16(SDA)
SDA_OB: U18.20(SDA) U19.20(SDA) U21.5(SDA) U23.17(SDA) ; also sheet 1,5
SENSOR_INT: U18.3(P0_2) ; also sheet 1
SIM_CD: J5.DSW(SW) R49.1 U18.11(P1_1)
SIM_CLK: $3_190_$_2021-12-10_02-09-55.71(SIM_CLK) J5.3(CLK)
SIM_DATA: $3_190_$_2021-12-10_02-09-55.73(SIM_DATA) J5.7(I/O)
SIM_RST: $3_190_$_2021-12-10_02-09-55.69(SIM_RST) J5.2(RST)
SIM_VCC: $3_190_$_2021-12-10_02-09-55.67(SIM_VCC) J5.1(VCC)
SYSCORE: C49.1 R54.1 R55.1 U24.5(VCC) U25.1(VDD) ; also sheet 1,2
TALON1_EN: U19.4(P0_3) ; also sheet 6
TALON1_GPIOA: $3_190_$_2021-12-10_02-09-55.37(ADC3) ; also sheet 6
TALON1_GPIOB: $3_190_$_2021-12-10_02-09-55.72(PWM3) ; also sheet 6
TALON1_I2C_EN: U19.2(P0_1) ; also sheet 6
TALON1_SEL: U19.1(P0_0) ; also sheet 6
TALON2_EN: U19.8(P0_7) ; also sheet 6
TALON2_GPIOA: $3_190_$_2021-12-10_02-09-55.35(ADC2) ; also sheet 6
TALON2_GPIOB: $3_190_$_2021-12-10_02-09-55.70(PWM2) ; also sheet 6
TALON2_I2C_EN: U19.6(P0_5) ; also sheet 6
TALON2_SEL: U19.5(P0_4) ; also sheet 6
TALON3_EN: U19.13(P1_3) ; also sheet 6
TALON3_GPIOA: $3_190_$_2021-12-10_02-09-55.33(ADC1) ; also sheet 6
TALON3_GPIOB: $3_190_$_2021-12-10_02-09-55.68(PWM1) ; also sheet 6
TALON3_I2C_EN: U19.11(P1_1) ; also sheet 6
TALON3_SEL: U19.10(P1_0) ; also sheet 6
TALON4_EN: U19.17(P1_7) ; also sheet 6
TALON4_GPIOA: $3_190_$_2021-12-10_02-09-55.23(ADC0) ; also sheet 6
TALON4_GPIOB: $3_190_$_2021-12-10_02-09-55.66(PWM0) ; also sheet 6
TALON4_I2C_EN: U19.15(P1_5) ; also sheet 6
TALON4_SEL: U19.14(P1_4) ; also sheet 6
TALON_INT: $3_190_$_2021-12-10_02-09-55.41(ADC4) R38.1 U19.22(!INT)
TEST: $3_190_$_2021-12-10_02-09-55.40(CTS) R54.2 S3.3(S)
TIMEPULSE: $3_190_$_2021-12-10_02-09-55.47(ADC7) FB3.1
TIMEPULSE_CLEAN: FB3.2 U20.4(TIMEPULSE)
TX: $3_190_$_2021-12-10_02-09-55.36(TX) ; also sheet 1,6
V_ANT: R48.2 U20.15(V_ANT)
VBULK: $3_190_$_2021-12-10_02-09-55.2(VCC) $3_190_$_2021-12-10_02-09-55.4(VCC) $3_190_$_2021-12-10_02-09-55.6(VCC) $3_190_$_2021-12-10_02-09-55.8(VCC) ; also sheet 1,2
VBULK_PG: U18.2(P0_1) ; also sheet 2
VCC_RF: C42.1 R48.1 U20.14(VCC_RF)
VDD_CLK: U29.3(VCC) ; also sheet 2
VUSB: $3_190_$_2021-12-10_02-09-55.16(VBUS) R40.2 ; also sheet 1,2,3
WDT_DONE: $3_190_$_2021-12-10_02-09-55.42(RTS) U25.4(DONE)
Unconnected: $3_190_$_2021-12-10_02-09-55.14(NC) $3_190_$_2021-12-10_02-09-55.17(NFC1) $3_190_$_2021-12-10_02-09-55.18(NC) $3_190_$_2021-12-10_02-09-55.19(NFC2) $3_190_$_2021-12-10_02-09-55.44(UB_USB_P) $3_190_$_2021-12-10_02-09-55.46(UB_USB_N) $3_190_$_2021-12-10_02-09-55.51(NC) $3_190_$_2021-12-10_02-09-55.53(NC) $3_190_$_2021-12-10_02-09-55.55(NC) $3_190_$_2021-12-10_02-09-55.57(NC) $3_190_$_2021-12-10_02-09-55.58(MC) $3_190_$_2021-12-10_02-09-55.59(NC) $3_190_$_2021-12-10_02-09-55.60(NC) $3_190_$_2021-12-10_02-09-55.75(NC) $3_190_$_2021-12-10_02-09-55.!RESET $3_190_$_2021-12-10_02-09-55.SWCLK $3_190_$_2021-12-10_02-09-55.SWDIO $3_190_$_2021-12-10_02-09-55.SWO U20.2(TXD) U20.3(RXD) U20.13(LNA_EN) U20.18(SAFEBOOT_N) U21.2(X2) U25.5(WAKE) U26.5(WAKE)

### Notes on the sheet
- Sensor | Sensor | Sensor | GPS | GPS | Cell | Cell | Other
- ADR: 0x52
- Select address!
- FLEX
- On Board Interface | Talon Interface
- ADR: 0x20 | ADR: 0x21
- ADR 0x6F
- Particle uses 1k on eval board
  Test 4.7k (or more) for reduced power consumption
- Verify!
- Verify!
- D3
- D2
- uBlox Data Port
- Should this be used?
- DNP and use internal pullup on IO exp to reduce Iq
- CI160808-33NJ
- ADR: 0x42
- Fix I2C naming/connections

## Sheet 5 of 6
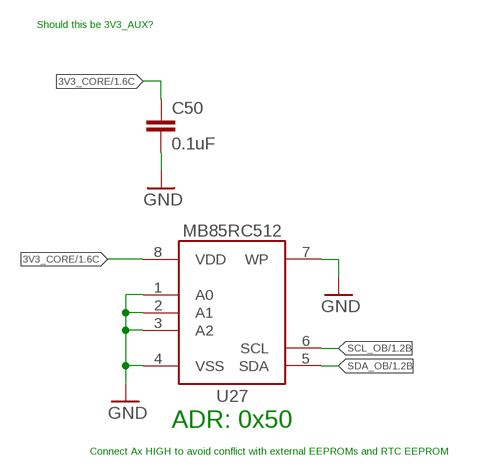
[diagram p4: schematic, sheet 5]

### Parts
C50  0.1uF  C-EU0.1UFC0402  [C0402]
U27  MB85RC  [SO08]

### Nets
3V3_CORE: C50.1 U27.8(VDD) ; also sheet 1,2,3,4
GND: C50.2 U27.1(A0) U27.2(A1) U27.3(A2) U27.4(VSS) U27.7(WP) ; also sheet 1,2,3,4,6
SCL_OB: U27.6(SCL) ; also sheet 1,4
SDA_OB: U27.5(SDA) ; also sheet 1,4

### Notes on the sheet
- Should this be 3V3_AUX?
- ADR: 0x50
- Connect Ax HIGH to avoid conflict with external EEPROMs and RTC EEPROM

## Sheet 6 of 6
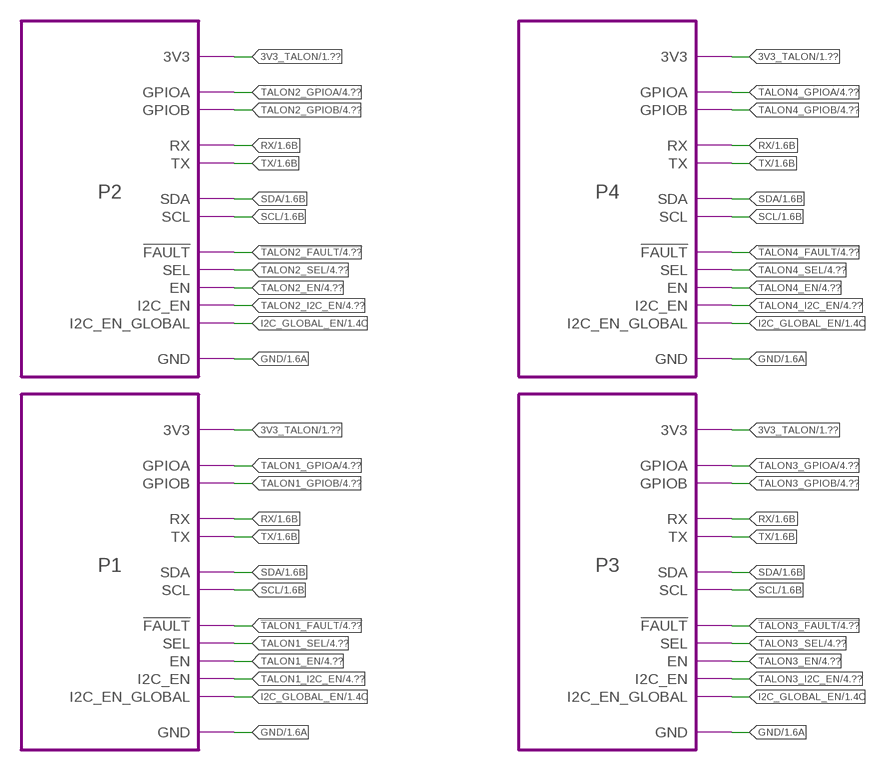
[diagram p5: schematic, sheet 6]

### Module instances
P1 = TALON
P2 = TALON
P3 = TALON
P4 = TALON

### Nets
3V3_TALON: port P1.3V3 P2.3V3 P3.3V3 P4.3V3 ; also sheet 1,3
!TALON1_FAULT: port P1.!FAULT ; also sheet 4
!TALON2_FAULT: port P2.!FAULT ; also sheet 4
!TALON3_FAULT: port P3.!FAULT ; also sheet 4
!TALON4_FAULT: port P4.!FAULT ; also sheet 4
GND: port P1.GND P2.GND P3.GND P4.GND ; also sheet 1,2,3,4,5
I2C_GLOBAL_EN: port P1.I2C_EN_GLOBAL P2.I2C_EN_GLOBAL P3.I2C_EN_GLOBAL P4.I2C_EN_GLOBAL ; also sheet 1,4
RX: port P1.RX P2.RX P3.RX P4.RX ; also sheet 1,4
SCL: port P1.SCL P2.SCL P3.SCL P4.SCL ; also sheet 1,4
SDA: port P1.SDA P2.SDA P3.SDA P4.SDA ; also sheet 1,4
TALON1_EN: port P1.EN ; also sheet 4
TALON1_GPIOA: port P1.GPIOA ; also sheet 4
TALON1_GPIOB: port P1.GPIOB ; also sheet 4
TALON1_I2C_EN: port P1.I2C_EN ; also sheet 4
TALON1_SEL: port P1.SEL ; also sheet 4
TALON2_EN: port P2.EN ; also sheet 4
TALON2_GPIOA: port P2.GPIOA ; also sheet 4
TALON2_GPIOB: port P2.GPIOB ; also sheet 4
TALON2_I2C_EN: port P2.I2C_EN ; also sheet 4
TALON2_SEL: port P2.SEL ; also sheet 4
TALON3_EN: port P3.EN ; also sheet 4
TALON3_GPIOA: port P3.GPIOA ; also sheet 4
TALON3_GPIOB: port P3.GPIOB ; also sheet 4
TALON3_I2C_EN: port P3.I2C_EN ; also sheet 4
TALON3_SEL: port P3.SEL ; also sheet 4
TALON4_EN: port P4.EN ; also sheet 4
TALON4_GPIOA: port P4.GPIOA ; also sheet 4
TALON4_GPIOB: port P4.GPIOB ; also sheet 4
TALON4_I2C_EN: port P4.I2C_EN ; also sheet 4
TALON4_SEL: port P4.SEL ; also sheet 4
TX: port P1.TX P2.TX P3.TX P4.TX ; also sheet 1,4

## Power pins joined to a net without a drawn wire
UB_VBUS: $3_190_$_2021-12-10_02-09-55.74(UB_VBUS)
VPP: J5.6(VPP)

## Library data of the parts
$3_190_$_2021-12-10_02-09-55 = Particle-Devices:B_SERIES_M.2EKEY_: Particle B Series SoM 3042 M.2 Connector with E Key Width = 30mm Length = 42mm Height = 4.2mm Key = E; DIGIKEY: A115904CT-ND; MF: TE; MPN: 2199230-4
BT1 = bschulz:BATTERY_COIN: Coin Cell Battery Holder; DIGIKEY: P044-ND; MF: Panasonic; MPN: ML-621S/DN
C1 C3-C10 C12 C38 C39 C41 C43-C46 C48-C52 C57 = bschulz_passives:C-EU: CAPACITOR, European symbol; DIGIKEY: 490-4759-1-ND; MF: Murata; MPN: GCM155R71C104KA55D
C2 = bschulz_passives:C-EU: CAPACITOR, European symbol; DIGIKEY: 1276-1183-1-ND; MF: Samsung; MPN: CL10A225KQ8NNNC
C11 C14 C15 C20 C22 C27 C40 C47 C53-C56 = bschulz_passives:C-EU: CAPACITOR, European symbol; DIGIKEY: 587-2984-1-ND; MF: Yaiyo Yuden; MPN: TMK107B7105KA-T
C13 C16-C18 C34 = bschulz_passives:C-EU: CAPACITOR, European symbol; DIGIKEY: 490-9952-1-ND; MF: Murata; MPN: GRM219R61C226ME15L
C19 = bschulz_passives:C-EU: CAPACITOR, European symbol; DIGIKEY: 490-3244-1-ND; MF: Murata; MPN: GRM1555C1H102JA01D
C21 C25 = bschulz_passives:C-EU: CAPACITOR, European symbol; DIGIKEY: 490-4762-1-ND; MF: Murata; MPN: GCM155R71H103KA55D
C23 C29 = bschulz_passives:C-EU: CAPACITOR, European symbol; DIGIKEY: 490-5523-1-ND; MF: Murata; MPN: GRM21BR61E106KA73L
C24 = bschulz_passives:C-EU: CAPACITOR, European symbol; DIGIKEY: 399-1018-1-ND; MF: Kemet; MPN: C0402C390J5GAC7867
C26 C58 = bschulz_passives:C-EU: CAPACITOR, European symbol; DIGIKEY: 311-1024-1-ND; MF: Yageo; MPN: CC0402JRNPO9BN101
C28 = bschulz_passives:CTANT_EU: Genaric Tantalum Capacitor; DIGIKEY: 478-5231-1-ND; MF: Kyocera AVX; MPN: TPSB107M010R0400
C30 = bschulz_passives:CTANT_EU: Genaric Tantalum Capacitor; DIGIKEY: 399-9744-1-ND; MF: Kemet; MPN: T491D227M010AT
C31 = bschulz_passives:C-EU: CAPACITOR, European symbol; DIGIKEY: 399-4930-1-ND; MF: Kemet; MPN: C0805C155K4RACTU
C32 = bschulz_passives:C-EU: CAPACITOR, European symbol; DIGIKEY: 490-3254-1-ND; MF: Murata; MPN: GRM155R71E473KA88D
C33 = bschulz_passives:C-EU: CAPACITOR, European symbol; DIGIKEY: 399-7415-1-ND; MF: Kemet; MPN: C0805C475K4RACTU
C35-C37 = bschulz_passives:C-EU: CAPACITOR, European symbol; DIGIKEY: 490-6473-1-ND; MF: Murata; MPN: GRM21BR61C106KE15K
C42 = bschulz_passives:C-EU: CAPACITOR, European symbol; DIGIKEY: 490-10670-1-ND; MF: Murata; MPN: GCM1555C1H470JA16D
D1 D12 D18 = bschulz:LED: Genaric LED; DIGIKEY: 732-4978-1-ND; MF: Wurth; MPN: 150060RS75000
D2 = bschulz:RCLAMP3654: USB ESD Clamping Diode Array Digikey: RCLAMP3654PATCTCT-ND <https://www.digikey.com/en/products/detail/semtech-corporation/RCLAMP3654PATCT/2603582>; DIGIKEY: RCLAMP3654PATCTCT-ND; DISP: RClamp3654; MF: Semtech; MPN: RCLAMP3654PATCT
D3 = bschulz:DIODE_SCHOTTKY: Generic Shottky Diode; DIGIKEY: 641-1747-1-ND; MF: Comchip; MPN: CDBA3100-HF
D4 D6 = bschulz:DIODE_CC: Dual Diode, Common Cathode BAT54C Vr, max: 30V Iavg: 200mA Vf: 800mv @ 100mA Reverse Leakage: 2μA @ 25V SDM40E20LC Vr, max: 20V Iavg: 400mA Vf: 310mv @ 100mA Reverse Leakage: 250μA @ 20V; DIGIKEY: BAT54CLT1GOSCT-ND; MF: ON Semiconductor; MPN: BAT54CLT1G
D5 D10 D13 D15 D16 = bschulz:LED: Genaric LED; DIGIKEY: 732-4971-1-ND; MF: Wurth; MPN: 150060GS75000
D7 D11 D14 D17 = bschulz:LED: Genaric LED; DIGIKEY: 732-4981-1-ND; MF: Wurth; MPN: 150060YS75000
D8 = bschulz:CLVBA-FKA: Cree RGB LED, Small Package, Common Anode, CLVBA-FKA Digikey: https://www.digikey.com/product-detail/en/cree-inc/CLVBA-FKA-CAEDH8BBB7A363/CLVBA-FKA-CAEDH8BBB7A363CT-ND/2650500; DIGIKEY: CLVBA-FKA-CAEDH8BBB7A363CT-ND; MF: Cree; MPN: CLVBA-FKA-CAEDH8BBB7A363
D9 D19 = bschulz:DIODE_SCHOTTKY: Generic Shottky Diode; DIGIKEY: BAT54WS-TPCT-ND; MF: Micro Commercial; MPN: BAT54WS-TP
FB1-FB5 = bschulz:FERRITE_BEAD: Genaric Ferrite Bead Power Line, 30Ω @ 100MHz 490-1035-1-ND <https://www.digikey.com/product-detail/en/murata-electronics-north-america/BLM18PG300SN1D/490-1035-1-ND/584483> Signal Line, 1kΩ @ 100MHz 490-1024-1-ND <https://www.digikey.com/product-detail/en/murata-electronics-north-america/BLM18BD102SN1D/490-1024-1-ND/584472>; DIGIKEY: 490-4003-1-ND; MF: Murata; MPN: BLM15HD102SN1D
H1-H4 = bschulz:MOUNTING_HOLE: Genaric Mechanical Mounting Hole Hole diameter based on max body diameter + 15% Keepout ring is for diameter of socket cap screw (minimum required clearance) TPlace ring is for diameter of pan head screw (recomended clearance) Specifications: Socket Cap <http://fastener-express.com/fastener-technical/SocketscapSS-Alloy.pdf> Button Head Socket Cap <http://fastener-express.com/fastener-technical/Button-Socket-alloy.pdf> Pan Head <http://fastener-express.com/fastener-technical/pan-machine-Screws.pdf>; DIGIKEY: DNP; MF: N/A; MPN: DNP
J1 = bschulz:CONN_02: Genaric 2 terminal header SCREW_2.54 <https://www.digikey.com/product-detail/en/on-shore-technology-inc/OSTVN02A150/ED10561-ND/1588862> 39532_RA <https://www.digikey.com/product-detail/en/molex/0395321002/WM7845-ND/1280696>; DIGIKEY: 455-1749-1-ND; MF: JST; MPN: S2B-PH-SM4-TB(LF)(SN); PROD_ID: CONN-11443
J2 = bschulz:CONN_02: Genaric 2 terminal header SCREW_2.54 <https://www.digikey.com/product-detail/en/on-shore-technology-inc/OSTVN02A150/ED10561-ND/1588862> 39532_RA <https://www.digikey.com/product-detail/en/molex/0395321002/WM7845-ND/1280696>; DIGIKEY: ED2635-ND; MF: On Shore; MPN: OSTTE020161
J3 = bschulz:GEMS_POWER_PLUG: Power Plug For GEMS Based Systems Both Input and Output versions; DIGIKEY: WM1815-ND; DISP: Input; MF: Molex; MPN: 0430450600
J4 = SparkFun-Connectors:U.FL2PIN: SMD Antenna Connector - U.FL 2mm height, 3.0mm x 3.0mm receptacle size. SparkFun Products: SparkFun WiFi Shield - ESP8266 <https://www.sparkfun.com/products/13287> SparkFun ESP8266 Thing <https://www.sparkfun.com/products/13231> SparkFun MiniGen - Pro Mini Signal Generator Shield <https://www.sparkfun.com/products/11420>; DIGIKEY: WM5587CT-ND; MF: Molex; MPN: 0734120110; PROD_ID: CONN-09193; SF_ID: WRL-09144
J5 = bschulz:SIM_CD: SIM Card Holder with Card Detect; DIGIKEY: 670-2967-1-ND; MF: JAE; MPN: SF72S006VBDR2500
L1 L3 = bschulz:INDUCTOR: Genaric Inductor; DIGIKEY: 732-11310-1-ND; MF: Wurth; MPN: 78438356010
L2 = bschulz:INDUCTOR: Genaric Inductor; DIGIKEY: 732-744383560047HTCT-ND; MF: Wurth; MPN: 744383560047HT
Q1 Q4 = bschulz:MOSFET-NCH: N-channel MOSFET Small Signal/Low Power: BSS138 2N7002P 2N7002PW RE1C002UN; DIGIKEY: DMG3404L-7DICT-ND; MF: Diodes Incorporated; MPN: DMG3404L-7
Q2 Q3 = bschulz:MOSFET_PCH: P-channel MOSFETs Voltage controlled devices that allow control of high current outputs. SparkFun Products: SparkFun ESP32 Thing <https://www.sparkfun.com/products/13907> SparkFun ESP8266 Thing <https://www.sparkfun.com/products/13231>; DIGIKEY: DMP3036SFG-7DICT-ND; MF: Diodes Incorporated; MPN: DMP3036SFG-7
Q5 Q6 = bschulz:MOSFET-PCH: P-channel MOSFET Small Signal/Low Power:; DIGIKEY: 1727-1148-1-ND; MF: Nexperia; MPN: NX2301P,215
R1 R2 R11 R19 R26 R32 R35 R40-R42 R54 R55 = bschulz_passives:R-EU_: RESISTOR, European symbol Digikey Parts: Yageo, 0402 <https://www.digikey.com/products/en/resistors/chip-resistor-surface-mount/52?k=&pkeyword=&sv=0&s=4356&sf=1&FV=-1%7C13%2C7%7C2%2C1291%7C39157%2C1989%7C0%2C-8%7C52%2C3%7C1131%2C3%7C2503&quantity=&ColumnSort=0&page=1&stock=1&pageSize=25> Yageo, 0603 <https://www.digikey.com/products/en/resistors/chip-resistor-surface-mount/52?k=&pkeyword=&sv=0&pv1291=39245&sf=1&FV=-5%7C4356%2C-5%7C47360%2C-8%7C52%2C-1%7C13%2C7%7C2%2C1989%7C0&quantity=10&ColumnSort=1000011&page=1&stock=1&pageSize=25> Panasonic, 0603 <https://www.digikey.com/products/en/resistors/chip-resistor-surface-mount/52?k=&pkeyword=&pv252=68&sf=0&FV=ffec373d%2C1c0002%2C142c040c%2C1f140000%2Cffe00034%2C80002%2Cc0001&quantity=&ColumnSort=0&page=1&stock=1&pageSize=25> Panasonic, precision, 0603 <https://www.digikey.com/products/en/resistors/chip-resistor-surface-mount/52?FV=ffec4907%2Cfffc000a%2Cc0172%2C142c040c%2C1f140000%2Cffe00034%2C1c0002&quantity=100&ColumnSort=2085&page=1&stock=1&pageSize=25> Panasonic, 0805 <https://www.digikey.com/products/en/resistors/chip-resistor-surface-mount/52?k=&pkeyword=&pv3=1&sf=0&FV=ffec373d%2C1c0002%2C1f140000%2Cffe00034%2C142c040d&quantity=&ColumnSort=0&page=1&stock=1&pageSize=25> Rohm, current sense <https://www.digikey.com/products/en/resistors/chip-resistor-surface-mount/52?k=&pkeyword=&pv3=1&sf=0&FV=ffecb688%2C1f140000%2Cffe00034%2C1c0002&quantity=&ColumnSort=0&page=1&stock=1&pageSize=25> Vishay, pulse proof automotive <https://www.digikey.com/products/en/resistors/chip-resistor-surface-mount/52?k=&pkeyword=&pv7=2&sf=0&FV=ffec5d6b%2Cffe00034%2C1f140000&quantity=&ColumnSort=0&page=1&stock=1&pageSize=25>; DIGIKEY: 311-1.00MLRCT-ND; MF: Yageo; MPN: RC0402FR-071ML; VALUE_PART: 1M
R3 R20 = bschulz_passives:R-EU_: RESISTOR, European symbol Digikey Parts: Yageo, 0402 <https://www.digikey.com/products/en/resistors/chip-resistor-surface-mount/52?k=&pkeyword=&sv=0&s=4356&sf=1&FV=-1%7C13%2C7%7C2%2C1291%7C39157%2C1989%7C0%2C-8%7C52%2C3%7C1131%2C3%7C2503&quantity=&ColumnSort=0&page=1&stock=1&pageSize=25> Yageo, 0603 <https://www.digikey.com/products/en/resistors/chip-resistor-surface-mount/52?k=&pkeyword=&sv=0&pv1291=39245&sf=1&FV=-5%7C4356%2C-5%7C47360%2C-8%7C52%2C-1%7C13%2C7%7C2%2C1989%7C0&quantity=10&ColumnSort=1000011&page=1&stock=1&pageSize=25> Panasonic, 0603 <https://www.digikey.com/products/en/resistors/chip-resistor-surface-mount/52?k=&pkeyword=&pv252=68&sf=0&FV=ffec373d%2C1c0002%2C142c040c%2C1f140000%2Cffe00034%2C80002%2Cc0001&quantity=&ColumnSort=0&page=1&stock=1&pageSize=25> Panasonic, precision, 0603 <https://www.digikey.com/products/en/resistors/chip-resistor-surface-mount/52?FV=ffec4907%2Cfffc000a%2Cc0172%2C142c040c%2C1f140000%2Cffe00034%2C1c0002&quantity=100&ColumnSort=2085&page=1&stock=1&pageSize=25> Panasonic, 0805 <https://www.digikey.com/products/en/resistors/chip-resistor-surface-mount/52?k=&pkeyword=&pv3=1&sf=0&FV=ffec373d%2C1c0002%2C1f140000%2Cffe00034%2C142c040d&quantity=&ColumnSort=0&page=1&stock=1&pageSize=25> Rohm, current sense <https://www.digikey.com/products/en/resistors/chip-resistor-surface-mount/52?k=&pkeyword=&pv3=1&sf=0&FV=ffecb688%2C1f140000%2Cffe00034%2C1c0002&quantity=&ColumnSort=0&page=1&stock=1&pageSize=25> Vishay, pulse proof automotive <https://www.digikey.com/products/en/resistors/chip-resistor-surface-mount/52?k=&pkeyword=&pv7=2&sf=0&FV=ffec5d6b%2Cffe00034%2C1f140000&quantity=&ColumnSort=0&page=1&stock=1&pageSize=25>; DIGIKEY: CR0402-FX-2002GLFCT-ND; MF: Bourns; MPN: CR0402-FX-2002GLF; VALUE_PART: 20k
R4 = bschulz_passives:R-EU_: RESISTOR, European symbol Digikey Parts: Yageo, 0402 <https://www.digikey.com/products/en/resistors/chip-resistor-surface-mount/52?k=&pkeyword=&sv=0&s=4356&sf=1&FV=-1%7C13%2C7%7C2%2C1291%7C39157%2C1989%7C0%2C-8%7C52%2C3%7C1131%2C3%7C2503&quantity=&ColumnSort=0&page=1&stock=1&pageSize=25> Yageo, 0603 <https://www.digikey.com/products/en/resistors/chip-resistor-surface-mount/52?k=&pkeyword=&sv=0&pv1291=39245&sf=1&FV=-5%7C4356%2C-5%7C47360%2C-8%7C52%2C-1%7C13%2C7%7C2%2C1989%7C0&quantity=10&ColumnSort=1000011&page=1&stock=1&pageSize=25> Panasonic, 0603 <https://www.digikey.com/products/en/resistors/chip-resistor-surface-mount/52?k=&pkeyword=&pv252=68&sf=0&FV=ffec373d%2C1c0002%2C142c040c%2C1f140000%2Cffe00034%2C80002%2Cc0001&quantity=&ColumnSort=0&page=1&stock=1&pageSize=25> Panasonic, precision, 0603 <https://www.digikey.com/products/en/resistors/chip-resistor-surface-mount/52?FV=ffec4907%2Cfffc000a%2Cc0172%2C142c040c%2C1f140000%2Cffe00034%2C1c0002&quantity=100&ColumnSort=2085&page=1&stock=1&pageSize=25> Panasonic, 0805 <https://www.digikey.com/products/en/resistors/chip-resistor-surface-mount/52?k=&pkeyword=&pv3=1&sf=0&FV=ffec373d%2C1c0002%2C1f140000%2Cffe00034%2C142c040d&quantity=&ColumnSort=0&page=1&stock=1&pageSize=25> Rohm, current sense <https://www.digikey.com/products/en/resistors/chip-resistor-surface-mount/52?k=&pkeyword=&pv3=1&sf=0&FV=ffecb688%2C1f140000%2Cffe00034%2C1c0002&quantity=&ColumnSort=0&page=1&stock=1&pageSize=25> Vishay, pulse proof automotive <https://www.digikey.com/products/en/resistors/chip-resistor-surface-mount/52?k=&pkeyword=&pv7=2&sf=0&FV=ffec5d6b%2Cffe00034%2C1f140000&quantity=&ColumnSort=0&page=1&stock=1&pageSize=25>; DIGIKEY: 311-2KLRCT-ND; MF: Yageo; MPN: RC0402FR-072KL; VALUE_PART: 2k
R5 R13 R25 R34 R36 = bschulz_passives:R-EU_: RESISTOR, European symbol Digikey Parts: Yageo, 0402 <https://www.digikey.com/products/en/resistors/chip-resistor-surface-mount/52?k=&pkeyword=&sv=0&s=4356&sf=1&FV=-1%7C13%2C7%7C2%2C1291%7C39157%2C1989%7C0%2C-8%7C52%2C3%7C1131%2C3%7C2503&quantity=&ColumnSort=0&page=1&stock=1&pageSize=25> Yageo, 0603 <https://www.digikey.com/products/en/resistors/chip-resistor-surface-mount/52?k=&pkeyword=&sv=0&pv1291=39245&sf=1&FV=-5%7C4356%2C-5%7C47360%2C-8%7C52%2C-1%7C13%2C7%7C2%2C1989%7C0&quantity=10&ColumnSort=1000011&page=1&stock=1&pageSize=25> Panasonic, 0603 <https://www.digikey.com/products/en/resistors/chip-resistor-surface-mount/52?k=&pkeyword=&pv252=68&sf=0&FV=ffec373d%2C1c0002%2C142c040c%2C1f140000%2Cffe00034%2C80002%2Cc0001&quantity=&ColumnSort=0&page=1&stock=1&pageSize=25> Panasonic, precision, 0603 <https://www.digikey.com/products/en/resistors/chip-resistor-surface-mount/52?FV=ffec4907%2Cfffc000a%2Cc0172%2C142c040c%2C1f140000%2Cffe00034%2C1c0002&quantity=100&ColumnSort=2085&page=1&stock=1&pageSize=25> Panasonic, 0805 <https://www.digikey.com/products/en/resistors/chip-resistor-surface-mount/52?k=&pkeyword=&pv3=1&sf=0&FV=ffec373d%2C1c0002%2C1f140000%2Cffe00034%2C142c040d&quantity=&ColumnSort=0&page=1&stock=1&pageSize=25> Rohm, current sense <https://www.digikey.com/products/en/resistors/chip-resistor-surface-mount/52?k=&pkeyword=&pv3=1&sf=0&FV=ffecb688%2C1f140000%2Cffe00034%2C1c0002&quantity=&ColumnSort=0&page=1&stock=1&pageSize=25> Vishay, pulse proof automotive <https://www.digikey.com/products/en/resistors/chip-resistor-surface-mount/52?k=&pkeyword=&pv7=2&sf=0&FV=ffec5d6b%2Cffe00034%2C1f140000&quantity=&ColumnSort=0&page=1&stock=1&pageSize=25>; DIGIKEY: RHM.002AJCT-ND; MF: Rohm; MPN: PMR10EZPFV2L00
R6 R7 R17 = bschulz_passives:R-EU_: RESISTOR, European symbol Digikey Parts: Yageo, 0402 <https://www.digikey.com/products/en/resistors/chip-resistor-surface-mount/52?k=&pkeyword=&sv=0&s=4356&sf=1&FV=-1%7C13%2C7%7C2%2C1291%7C39157%2C1989%7C0%2C-8%7C52%2C3%7C1131%2C3%7C2503&quantity=&ColumnSort=0&page=1&stock=1&pageSize=25> Yageo, 0603 <https://www.digikey.com/products/en/resistors/chip-resistor-surface-mount/52?k=&pkeyword=&sv=0&pv1291=39245&sf=1&FV=-5%7C4356%2C-5%7C47360%2C-8%7C52%2C-1%7C13%2C7%7C2%2C1989%7C0&quantity=10&ColumnSort=1000011&page=1&stock=1&pageSize=25> Panasonic, 0603 <https://www.digikey.com/products/en/resistors/chip-resistor-surface-mount/52?k=&pkeyword=&pv252=68&sf=0&FV=ffec373d%2C1c0002%2C142c040c%2C1f140000%2Cffe00034%2C80002%2Cc0001&quantity=&ColumnSort=0&page=1&stock=1&pageSize=25> Panasonic, precision, 0603 <https://www.digikey.com/products/en/resistors/chip-resistor-surface-mount/52?FV=ffec4907%2Cfffc000a%2Cc0172%2C142c040c%2C1f140000%2Cffe00034%2C1c0002&quantity=100&ColumnSort=2085&page=1&stock=1&pageSize=25> Panasonic, 0805 <https://www.digikey.com/products/en/resistors/chip-resistor-surface-mount/52?k=&pkeyword=&pv3=1&sf=0&FV=ffec373d%2C1c0002%2C1f140000%2Cffe00034%2C142c040d&quantity=&ColumnSort=0&page=1&stock=1&pageSize=25> Rohm, current sense <https://www.digikey.com/products/en/resistors/chip-resistor-surface-mount/52?k=&pkeyword=&pv3=1&sf=0&FV=ffecb688%2C1f140000%2Cffe00034%2C1c0002&quantity=&ColumnSort=0&page=1&stock=1&pageSize=25> Vishay, pulse proof automotive <https://www.digikey.com/products/en/resistors/chip-resistor-surface-mount/52?k=&pkeyword=&pv7=2&sf=0&FV=ffec5d6b%2Cffe00034%2C1f140000&quantity=&ColumnSort=0&page=1&stock=1&pageSize=25>; DIGIKEY: CRF0805-FZ-R010ELFCT-ND; MF: Bourns; MPN: CRF0805-FZ-R010ELF
R8 R14 R15 R21 R30 R31 R38 R39 R47 R49 R53 R57 = bschulz_passives:R-EU_: RESISTOR, European symbol Digikey Parts: Yageo, 0402 <https://www.digikey.com/products/en/resistors/chip-resistor-surface-mount/52?k=&pkeyword=&sv=0&s=4356&sf=1&FV=-1%7C13%2C7%7C2%2C1291%7C39157%2C1989%7C0%2C-8%7C52%2C3%7C1131%2C3%7C2503&quantity=&ColumnSort=0&page=1&stock=1&pageSize=25> Yageo, 0603 <https://www.digikey.com/products/en/resistors/chip-resistor-surface-mount/52?k=&pkeyword=&sv=0&pv1291=39245&sf=1&FV=-5%7C4356%2C-5%7C47360%2C-8%7C52%2C-1%7C13%2C7%7C2%2C1989%7C0&quantity=10&ColumnSort=1000011&page=1&stock=1&pageSize=25> Panasonic, 0603 <https://www.digikey.com/products/en/resistors/chip-resistor-surface-mount/52?k=&pkeyword=&pv252=68&sf=0&FV=ffec373d%2C1c0002%2C142c040c%2C1f140000%2Cffe00034%2C80002%2Cc0001&quantity=&ColumnSort=0&page=1&stock=1&pageSize=25> Panasonic, precision, 0603 <https://www.digikey.com/products/en/resistors/chip-resistor-surface-mount/52?FV=ffec4907%2Cfffc000a%2Cc0172%2C142c040c%2C1f140000%2Cffe00034%2C1c0002&quantity=100&ColumnSort=2085&page=1&stock=1&pageSize=25> Panasonic, 0805 <https://www.digikey.com/products/en/resistors/chip-resistor-surface-mount/52?k=&pkeyword=&pv3=1&sf=0&FV=ffec373d%2C1c0002%2C1f140000%2Cffe00034%2C142c040d&quantity=&ColumnSort=0&page=1&stock=1&pageSize=25> Rohm, current sense <https://www.digikey.com/products/en/resistors/chip-resistor-surface-mount/52?k=&pkeyword=&pv3=1&sf=0&FV=ffecb688%2C1f140000%2Cffe00034%2C1c0002&quantity=&ColumnSort=0&page=1&stock=1&pageSize=25> Vishay, pulse proof automotive <https://www.digikey.com/products/en/resistors/chip-resistor-surface-mount/52?k=&pkeyword=&pv7=2&sf=0&FV=ffec5d6b%2Cffe00034%2C1f140000&quantity=&ColumnSort=0&page=1&stock=1&pageSize=25>; DIGIKEY: 311-100KLRCT-ND; MF: Yageo; MPN: RC0402FR-07100KL; VALUE_PART: 100k
R9 R10 = bschulz_passives:R-EU_: RESISTOR, European symbol Digikey Parts: Yageo, 0402 <https://www.digikey.com/products/en/resistors/chip-resistor-surface-mount/52?k=&pkeyword=&sv=0&s=4356&sf=1&FV=-1%7C13%2C7%7C2%2C1291%7C39157%2C1989%7C0%2C-8%7C52%2C3%7C1131%2C3%7C2503&quantity=&ColumnSort=0&page=1&stock=1&pageSize=25> Yageo, 0603 <https://www.digikey.com/products/en/resistors/chip-resistor-surface-mount/52?k=&pkeyword=&sv=0&pv1291=39245&sf=1&FV=-5%7C4356%2C-5%7C47360%2C-8%7C52%2C-1%7C13%2C7%7C2%2C1989%7C0&quantity=10&ColumnSort=1000011&page=1&stock=1&pageSize=25> Panasonic, 0603 <https://www.digikey.com/products/en/resistors/chip-resistor-surface-mount/52?k=&pkeyword=&pv252=68&sf=0&FV=ffec373d%2C1c0002%2C142c040c%2C1f140000%2Cffe00034%2C80002%2Cc0001&quantity=&ColumnSort=0&page=1&stock=1&pageSize=25> Panasonic, precision, 0603 <https://www.digikey.com/products/en/resistors/chip-resistor-surface-mount/52?FV=ffec4907%2Cfffc000a%2Cc0172%2C142c040c%2C1f140000%2Cffe00034%2C1c0002&quantity=100&ColumnSort=2085&page=1&stock=1&pageSize=25> Panasonic, 0805 <https://www.digikey.com/products/en/resistors/chip-resistor-surface-mount/52?k=&pkeyword=&pv3=1&sf=0&FV=ffec373d%2C1c0002%2C1f140000%2Cffe00034%2C142c040d&quantity=&ColumnSort=0&page=1&stock=1&pageSize=25> Rohm, current sense <https://www.digikey.com/products/en/resistors/chip-resistor-surface-mount/52?k=&pkeyword=&pv3=1&sf=0&FV=ffecb688%2C1f140000%2Cffe00034%2C1c0002&quantity=&ColumnSort=0&page=1&stock=1&pageSize=25> Vishay, pulse proof automotive <https://www.digikey.com/products/en/resistors/chip-resistor-surface-mount/52?k=&pkeyword=&pv7=2&sf=0&FV=ffec5d6b%2Cffe00034%2C1f140000&quantity=&ColumnSort=0&page=1&stock=1&pageSize=25>; DIGIKEY: YAG3086CT-ND; MF: Yageo; MPN: RC0402FR-0727RL; VALUE_PART: 27
R12 R43 = bschulz_passives:R-EU_: RESISTOR, European symbol Digikey Parts: Yageo, 0402 <https://www.digikey.com/products/en/resistors/chip-resistor-surface-mount/52?k=&pkeyword=&sv=0&s=4356&sf=1&FV=-1%7C13%2C7%7C2%2C1291%7C39157%2C1989%7C0%2C-8%7C52%2C3%7C1131%2C3%7C2503&quantity=&ColumnSort=0&page=1&stock=1&pageSize=25> Yageo, 0603 <https://www.digikey.com/products/en/resistors/chip-resistor-surface-mount/52?k=&pkeyword=&sv=0&pv1291=39245&sf=1&FV=-5%7C4356%2C-5%7C47360%2C-8%7C52%2C-1%7C13%2C7%7C2%2C1989%7C0&quantity=10&ColumnSort=1000011&page=1&stock=1&pageSize=25> Panasonic, 0603 <https://www.digikey.com/products/en/resistors/chip-resistor-surface-mount/52?k=&pkeyword=&pv252=68&sf=0&FV=ffec373d%2C1c0002%2C142c040c%2C1f140000%2Cffe00034%2C80002%2Cc0001&quantity=&ColumnSort=0&page=1&stock=1&pageSize=25> Panasonic, precision, 0603 <https://www.digikey.com/products/en/resistors/chip-resistor-surface-mount/52?FV=ffec4907%2Cfffc000a%2Cc0172%2C142c040c%2C1f140000%2Cffe00034%2C1c0002&quantity=100&ColumnSort=2085&page=1&stock=1&pageSize=25> Panasonic, 0805 <https://www.digikey.com/products/en/resistors/chip-resistor-surface-mount/52?k=&pkeyword=&pv3=1&sf=0&FV=ffec373d%2C1c0002%2C1f140000%2Cffe00034%2C142c040d&quantity=&ColumnSort=0&page=1&stock=1&pageSize=25> Rohm, current sense <https://www.digikey.com/products/en/resistors/chip-resistor-surface-mount/52?k=&pkeyword=&pv3=1&sf=0&FV=ffecb688%2C1f140000%2Cffe00034%2C1c0002&quantity=&ColumnSort=0&page=1&stock=1&pageSize=25> Vishay, pulse proof automotive <https://www.digikey.com/products/en/resistors/chip-resistor-surface-mount/52?k=&pkeyword=&pv7=2&sf=0&FV=ffec5d6b%2Cffe00034%2C1f140000&quantity=&ColumnSort=0&page=1&stock=1&pageSize=25>; DIGIKEY: 311-1.00KLRCT-ND; MF: Yageo; MPN: RC0402FR-071KL; VALUE_PART: 1k
R16 = bschulz_passives:R-EU_: RESISTOR, European symbol Digikey Parts: Yageo, 0402 <https://www.digikey.com/products/en/resistors/chip-resistor-surface-mount/52?k=&pkeyword=&sv=0&s=4356&sf=1&FV=-1%7C13%2C7%7C2%2C1291%7C39157%2C1989%7C0%2C-8%7C52%2C3%7C1131%2C3%7C2503&quantity=&ColumnSort=0&page=1&stock=1&pageSize=25> Yageo, 0603 <https://www.digikey.com/products/en/resistors/chip-resistor-surface-mount/52?k=&pkeyword=&sv=0&pv1291=39245&sf=1&FV=-5%7C4356%2C-5%7C47360%2C-8%7C52%2C-1%7C13%2C7%7C2%2C1989%7C0&quantity=10&ColumnSort=1000011&page=1&stock=1&pageSize=25> Panasonic, 0603 <https://www.digikey.com/products/en/resistors/chip-resistor-surface-mount/52?k=&pkeyword=&pv252=68&sf=0&FV=ffec373d%2C1c0002%2C142c040c%2C1f140000%2Cffe00034%2C80002%2Cc0001&quantity=&ColumnSort=0&page=1&stock=1&pageSize=25> Panasonic, precision, 0603 <https://www.digikey.com/products/en/resistors/chip-resistor-surface-mount/52?FV=ffec4907%2Cfffc000a%2Cc0172%2C142c040c%2C1f140000%2Cffe00034%2C1c0002&quantity=100&ColumnSort=2085&page=1&stock=1&pageSize=25> Panasonic, 0805 <https://www.digikey.com/products/en/resistors/chip-resistor-surface-mount/52?k=&pkeyword=&pv3=1&sf=0&FV=ffec373d%2C1c0002%2C1f140000%2Cffe00034%2C142c040d&quantity=&ColumnSort=0&page=1&stock=1&pageSize=25> Rohm, current sense <https://www.digikey.com/products/en/resistors/chip-resistor-surface-mount/52?k=&pkeyword=&pv3=1&sf=0&FV=ffecb688%2C1f140000%2Cffe00034%2C1c0002&quantity=&ColumnSort=0&page=1&stock=1&pageSize=25> Vishay, pulse proof automotive <https://www.digikey.com/products/en/resistors/chip-resistor-surface-mount/52?k=&pkeyword=&pv7=2&sf=0&FV=ffec5d6b%2Cffe00034%2C1f140000&quantity=&ColumnSort=0&page=1&stock=1&pageSize=25>; DIGIKEY: 311-470KGRCT-ND; MF: Yageo; MPN: RC0603JR-07470KL; VALUE_PART: 470k
R18 = bschulz_passives:R-EU_: RESISTOR, European symbol Digikey Parts: Yageo, 0402 <https://www.digikey.com/products/en/resistors/chip-resistor-surface-mount/52?k=&pkeyword=&sv=0&s=4356&sf=1&FV=-1%7C13%2C7%7C2%2C1291%7C39157%2C1989%7C0%2C-8%7C52%2C3%7C1131%2C3%7C2503&quantity=&ColumnSort=0&page=1&stock=1&pageSize=25> Yageo, 0603 <https://www.digikey.com/products/en/resistors/chip-resistor-surface-mount/52?k=&pkeyword=&sv=0&pv1291=39245&sf=1&FV=-5%7C4356%2C-5%7C47360%2C-8%7C52%2C-1%7C13%2C7%7C2%2C1989%7C0&quantity=10&ColumnSort=1000011&page=1&stock=1&pageSize=25> Panasonic, 0603 <https://www.digikey.com/products/en/resistors/chip-resistor-surface-mount/52?k=&pkeyword=&pv252=68&sf=0&FV=ffec373d%2C1c0002%2C142c040c%2C1f140000%2Cffe00034%2C80002%2Cc0001&quantity=&ColumnSort=0&page=1&stock=1&pageSize=25> Panasonic, precision, 0603 <https://www.digikey.com/products/en/resistors/chip-resistor-surface-mount/52?FV=ffec4907%2Cfffc000a%2Cc0172%2C142c040c%2C1f140000%2Cffe00034%2C1c0002&quantity=100&ColumnSort=2085&page=1&stock=1&pageSize=25> Panasonic, 0805 <https://www.digikey.com/products/en/resistors/chip-resistor-surface-mount/52?k=&pkeyword=&pv3=1&sf=0&FV=ffec373d%2C1c0002%2C1f140000%2Cffe00034%2C142c040d&quantity=&ColumnSort=0&page=1&stock=1&pageSize=25> Rohm, current sense <https://www.digikey.com/products/en/resistors/chip-resistor-surface-mount/52?k=&pkeyword=&pv3=1&sf=0&FV=ffecb688%2C1f140000%2Cffe00034%2C1c0002&quantity=&ColumnSort=0&page=1&stock=1&pageSize=25> Vishay, pulse proof automotive <https://www.digikey.com/products/en/resistors/chip-resistor-surface-mount/52?k=&pkeyword=&pv7=2&sf=0&FV=ffec5d6b%2Cffe00034%2C1f140000&quantity=&ColumnSort=0&page=1&stock=1&pageSize=25>; DIGIKEY: 311-750HRCT-ND; MF: Yageo; MPN: RC0603FR-07750RL; VALUE_PART: 750
R22 R29 R33 R45 R46 R65 = bschulz_passives:R-EU_: RESISTOR, European symbol Digikey Parts: Yageo, 0402 <https://www.digikey.com/products/en/resistors/chip-resistor-surface-mount/52?k=&pkeyword=&sv=0&s=4356&sf=1&FV=-1%7C13%2C7%7C2%2C1291%7C39157%2C1989%7C0%2C-8%7C52%2C3%7C1131%2C3%7C2503&quantity=&ColumnSort=0&page=1&stock=1&pageSize=25> Yageo, 0603 <https://www.digikey.com/products/en/resistors/chip-resistor-surface-mount/52?k=&pkeyword=&sv=0&pv1291=39245&sf=1&FV=-5%7C4356%2C-5%7C47360%2C-8%7C52%2C-1%7C13%2C7%7C2%2C1989%7C0&quantity=10&ColumnSort=1000011&page=1&stock=1&pageSize=25> Panasonic, 0603 <https://www.digikey.com/products/en/resistors/chip-resistor-surface-mount/52?k=&pkeyword=&pv252=68&sf=0&FV=ffec373d%2C1c0002%2C142c040c%2C1f140000%2Cffe00034%2C80002%2Cc0001&quantity=&ColumnSort=0&page=1&stock=1&pageSize=25> Panasonic, precision, 0603 <https://www.digikey.com/products/en/resistors/chip-resistor-surface-mount/52?FV=ffec4907%2Cfffc000a%2Cc0172%2C142c040c%2C1f140000%2Cffe00034%2C1c0002&quantity=100&ColumnSort=2085&page=1&stock=1&pageSize=25> Panasonic, 0805 <https://www.digikey.com/products/en/resistors/chip-resistor-surface-mount/52?k=&pkeyword=&pv3=1&sf=0&FV=ffec373d%2C1c0002%2C1f140000%2Cffe00034%2C142c040d&quantity=&ColumnSort=0&page=1&stock=1&pageSize=25> Rohm, current sense <https://www.digikey.com/products/en/resistors/chip-resistor-surface-mount/52?k=&pkeyword=&pv3=1&sf=0&FV=ffecb688%2C1f140000%2Cffe00034%2C1c0002&quantity=&ColumnSort=0&page=1&stock=1&pageSize=25> Vishay, pulse proof automotive <https://www.digikey.com/products/en/resistors/chip-resistor-surface-mount/52?k=&pkeyword=&pv7=2&sf=0&FV=ffec5d6b%2Cffe00034%2C1f140000&quantity=&ColumnSort=0&page=1&stock=1&pageSize=25>; DIGIKEY: 311-10.0KLRCT-ND; MF: Yageo; MPN: RC0402FR-0710KL; VALUE_PART: 10k
R23 R37 = bschulz_passives:R-EU_: RESISTOR, European symbol Digikey Parts: Yageo, 0402 <https://www.digikey.com/products/en/resistors/chip-resistor-surface-mount/52?k=&pkeyword=&sv=0&s=4356&sf=1&FV=-1%7C13%2C7%7C2%2C1291%7C39157%2C1989%7C0%2C-8%7C52%2C3%7C1131%2C3%7C2503&quantity=&ColumnSort=0&page=1&stock=1&pageSize=25> Yageo, 0603 <https://www.digikey.com/products/en/resistors/chip-resistor-surface-mount/52?k=&pkeyword=&sv=0&pv1291=39245&sf=1&FV=-5%7C4356%2C-5%7C47360%2C-8%7C52%2C-1%7C13%2C7%7C2%2C1989%7C0&quantity=10&ColumnSort=1000011&page=1&stock=1&pageSize=25> Panasonic, 0603 <https://www.digikey.com/products/en/resistors/chip-resistor-surface-mount/52?k=&pkeyword=&pv252=68&sf=0&FV=ffec373d%2C1c0002%2C142c040c%2C1f140000%2Cffe00034%2C80002%2Cc0001&quantity=&ColumnSort=0&page=1&stock=1&pageSize=25> Panasonic, precision, 0603 <https://www.digikey.com/products/en/resistors/chip-resistor-surface-mount/52?FV=ffec4907%2Cfffc000a%2Cc0172%2C142c040c%2C1f140000%2Cffe00034%2C1c0002&quantity=100&ColumnSort=2085&page=1&stock=1&pageSize=25> Panasonic, 0805 <https://www.digikey.com/products/en/resistors/chip-resistor-surface-mount/52?k=&pkeyword=&pv3=1&sf=0&FV=ffec373d%2C1c0002%2C1f140000%2Cffe00034%2C142c040d&quantity=&ColumnSort=0&page=1&stock=1&pageSize=25> Rohm, current sense <https://www.digikey.com/products/en/resistors/chip-resistor-surface-mount/52?k=&pkeyword=&pv3=1&sf=0&FV=ffecb688%2C1f140000%2Cffe00034%2C1c0002&quantity=&ColumnSort=0&page=1&stock=1&pageSize=25> Vishay, pulse proof automotive <https://www.digikey.com/products/en/resistors/chip-resistor-surface-mount/52?k=&pkeyword=&pv7=2&sf=0&FV=ffec5d6b%2Cffe00034%2C1f140000&quantity=&ColumnSort=0&page=1&stock=1&pageSize=25>; DIGIKEY: CR0402-FX-2701GLFCT-ND; MF: Bourns; MPN: CR0402-FX-2701GLF; VALUE_PART: 2.7k
R24 = bschulz_passives:R-EU_: RESISTOR, European symbol Digikey Parts: Yageo, 0402 <https://www.digikey.com/products/en/resistors/chip-resistor-surface-mount/52?k=&pkeyword=&sv=0&s=4356&sf=1&FV=-1%7C13%2C7%7C2%2C1291%7C39157%2C1989%7C0%2C-8%7C52%2C3%7C1131%2C3%7C2503&quantity=&ColumnSort=0&page=1&stock=1&pageSize=25> Yageo, 0603 <https://www.digikey.com/products/en/resistors/chip-resistor-surface-mount/52?k=&pkeyword=&sv=0&pv1291=39245&sf=1&FV=-5%7C4356%2C-5%7C47360%2C-8%7C52%2C-1%7C13%2C7%7C2%2C1989%7C0&quantity=10&ColumnSort=1000011&page=1&stock=1&pageSize=25> Panasonic, 0603 <https://www.digikey.com/products/en/resistors/chip-resistor-surface-mount/52?k=&pkeyword=&pv252=68&sf=0&FV=ffec373d%2C1c0002%2C142c040c%2C1f140000%2Cffe00034%2C80002%2Cc0001&quantity=&ColumnSort=0&page=1&stock=1&pageSize=25> Panasonic, precision, 0603 <https://www.digikey.com/products/en/resistors/chip-resistor-surface-mount/52?FV=ffec4907%2Cfffc000a%2Cc0172%2C142c040c%2C1f140000%2Cffe00034%2C1c0002&quantity=100&ColumnSort=2085&page=1&stock=1&pageSize=25> Panasonic, 0805 <https://www.digikey.com/products/en/resistors/chip-resistor-surface-mount/52?k=&pkeyword=&pv3=1&sf=0&FV=ffec373d%2C1c0002%2C1f140000%2Cffe00034%2C142c040d&quantity=&ColumnSort=0&page=1&stock=1&pageSize=25> Rohm, current sense <https://www.digikey.com/products/en/resistors/chip-resistor-surface-mount/52?k=&pkeyword=&pv3=1&sf=0&FV=ffecb688%2C1f140000%2Cffe00034%2C1c0002&quantity=&ColumnSort=0&page=1&stock=1&pageSize=25> Vishay, pulse proof automotive <https://www.digikey.com/products/en/resistors/chip-resistor-surface-mount/52?k=&pkeyword=&pv7=2&sf=0&FV=ffec5d6b%2Cffe00034%2C1f140000&quantity=&ColumnSort=0&page=1&stock=1&pageSize=25>; DIGIKEY: 311-0.0JRCT-ND; MF: Yageo; MPN: RC0402JR-070RL; VALUE_PART: 0
R27 R28 R59-R64 R66 R67 = bschulz_passives:R-EU_: RESISTOR, European symbol Digikey Parts: Yageo, 0402 <https://www.digikey.com/products/en/resistors/chip-resistor-surface-mount/52?k=&pkeyword=&sv=0&s=4356&sf=1&FV=-1%7C13%2C7%7C2%2C1291%7C39157%2C1989%7C0%2C-8%7C52%2C3%7C1131%2C3%7C2503&quantity=&ColumnSort=0&page=1&stock=1&pageSize=25> Yageo, 0603 <https://www.digikey.com/products/en/resistors/chip-resistor-surface-mount/52?k=&pkeyword=&sv=0&pv1291=39245&sf=1&FV=-5%7C4356%2C-5%7C47360%2C-8%7C52%2C-1%7C13%2C7%7C2%2C1989%7C0&quantity=10&ColumnSort=1000011&page=1&stock=1&pageSize=25> Panasonic, 0603 <https://www.digikey.com/products/en/resistors/chip-resistor-surface-mount/52?k=&pkeyword=&pv252=68&sf=0&FV=ffec373d%2C1c0002%2C142c040c%2C1f140000%2Cffe00034%2C80002%2Cc0001&quantity=&ColumnSort=0&page=1&stock=1&pageSize=25> Panasonic, precision, 0603 <https://www.digikey.com/products/en/resistors/chip-resistor-surface-mount/52?FV=ffec4907%2Cfffc000a%2Cc0172%2C142c040c%2C1f140000%2Cffe00034%2C1c0002&quantity=100&ColumnSort=2085&page=1&stock=1&pageSize=25> Panasonic, 0805 <https://www.digikey.com/products/en/resistors/chip-resistor-surface-mount/52?k=&pkeyword=&pv3=1&sf=0&FV=ffec373d%2C1c0002%2C1f140000%2Cffe00034%2C142c040d&quantity=&ColumnSort=0&page=1&stock=1&pageSize=25> Rohm, current sense <https://www.digikey.com/products/en/resistors/chip-resistor-surface-mount/52?k=&pkeyword=&pv3=1&sf=0&FV=ffecb688%2C1f140000%2Cffe00034%2C1c0002&quantity=&ColumnSort=0&page=1&stock=1&pageSize=25> Vishay, pulse proof automotive <https://www.digikey.com/products/en/resistors/chip-resistor-surface-mount/52?k=&pkeyword=&pv7=2&sf=0&FV=ffec5d6b%2Cffe00034%2C1f140000&quantity=&ColumnSort=0&page=1&stock=1&pageSize=25>; DIGIKEY: A129619CT-ND; MF: TE; MPN: CRGCQ0402F220R; VALUE_PART: 220
R48 = bschulz_passives:R-EU_: RESISTOR, European symbol Digikey Parts: Yageo, 0402 <https://www.digikey.com/products/en/resistors/chip-resistor-surface-mount/52?k=&pkeyword=&sv=0&s=4356&sf=1&FV=-1%7C13%2C7%7C2%2C1291%7C39157%2C1989%7C0%2C-8%7C52%2C3%7C1131%2C3%7C2503&quantity=&ColumnSort=0&page=1&stock=1&pageSize=25> Yageo, 0603 <https://www.digikey.com/products/en/resistors/chip-resistor-surface-mount/52?k=&pkeyword=&sv=0&pv1291=39245&sf=1&FV=-5%7C4356%2C-5%7C47360%2C-8%7C52%2C-1%7C13%2C7%7C2%2C1989%7C0&quantity=10&ColumnSort=1000011&page=1&stock=1&pageSize=25> Panasonic, 0603 <https://www.digikey.com/products/en/resistors/chip-resistor-surface-mount/52?k=&pkeyword=&pv252=68&sf=0&FV=ffec373d%2C1c0002%2C142c040c%2C1f140000%2Cffe00034%2C80002%2Cc0001&quantity=&ColumnSort=0&page=1&stock=1&pageSize=25> Panasonic, precision, 0603 <https://www.digikey.com/products/en/resistors/chip-resistor-surface-mount/52?FV=ffec4907%2Cfffc000a%2Cc0172%2C142c040c%2C1f140000%2Cffe00034%2C1c0002&quantity=100&ColumnSort=2085&page=1&stock=1&pageSize=25> Panasonic, 0805 <https://www.digikey.com/products/en/resistors/chip-resistor-surface-mount/52?k=&pkeyword=&pv3=1&sf=0&FV=ffec373d%2C1c0002%2C1f140000%2Cffe00034%2C142c040d&quantity=&ColumnSort=0&page=1&stock=1&pageSize=25> Rohm, current sense <https://www.digikey.com/products/en/resistors/chip-resistor-surface-mount/52?k=&pkeyword=&pv3=1&sf=0&FV=ffecb688%2C1f140000%2Cffe00034%2C1c0002&quantity=&ColumnSort=0&page=1&stock=1&pageSize=25> Vishay, pulse proof automotive <https://www.digikey.com/products/en/resistors/chip-resistor-surface-mount/52?k=&pkeyword=&pv7=2&sf=0&FV=ffec5d6b%2Cffe00034%2C1f140000&quantity=&ColumnSort=0&page=1&stock=1&pageSize=25>; DIGIKEY: A129603CT-ND; MF: TE; MPN: CRGCQ0402F10R; VALUE_PART: 10
R50-R52 R68 = bschulz_passives:R-EU_: RESISTOR, European symbol Digikey Parts: Yageo, 0402 <https://www.digikey.com/products/en/resistors/chip-resistor-surface-mount/52?k=&pkeyword=&sv=0&s=4356&sf=1&FV=-1%7C13%2C7%7C2%2C1291%7C39157%2C1989%7C0%2C-8%7C52%2C3%7C1131%2C3%7C2503&quantity=&ColumnSort=0&page=1&stock=1&pageSize=25> Yageo, 0603 <https://www.digikey.com/products/en/resistors/chip-resistor-surface-mount/52?k=&pkeyword=&sv=0&pv1291=39245&sf=1&FV=-5%7C4356%2C-5%7C47360%2C-8%7C52%2C-1%7C13%2C7%7C2%2C1989%7C0&quantity=10&ColumnSort=1000011&page=1&stock=1&pageSize=25> Panasonic, 0603 <https://www.digikey.com/products/en/resistors/chip-resistor-surface-mount/52?k=&pkeyword=&pv252=68&sf=0&FV=ffec373d%2C1c0002%2C142c040c%2C1f140000%2Cffe00034%2C80002%2Cc0001&quantity=&ColumnSort=0&page=1&stock=1&pageSize=25> Panasonic, precision, 0603 <https://www.digikey.com/products/en/resistors/chip-resistor-surface-mount/52?FV=ffec4907%2Cfffc000a%2Cc0172%2C142c040c%2C1f140000%2Cffe00034%2C1c0002&quantity=100&ColumnSort=2085&page=1&stock=1&pageSize=25> Panasonic, 0805 <https://www.digikey.com/products/en/resistors/chip-resistor-surface-mount/52?k=&pkeyword=&pv3=1&sf=0&FV=ffec373d%2C1c0002%2C1f140000%2Cffe00034%2C142c040d&quantity=&ColumnSort=0&page=1&stock=1&pageSize=25> Rohm, current sense <https://www.digikey.com/products/en/resistors/chip-resistor-surface-mount/52?k=&pkeyword=&pv3=1&sf=0&FV=ffecb688%2C1f140000%2Cffe00034%2C1c0002&quantity=&ColumnSort=0&page=1&stock=1&pageSize=25> Vishay, pulse proof automotive <https://www.digikey.com/products/en/resistors/chip-resistor-surface-mount/52?k=&pkeyword=&pv7=2&sf=0&FV=ffec5d6b%2Cffe00034%2C1f140000&quantity=&ColumnSort=0&page=1&stock=1&pageSize=25>; DIGIKEY: 311-5.6KLRCT-ND; MF: Yageo; MPN: RC0402FR-075K6L; VALUE_PART: 5.6k
R56 = bschulz_passives:R-EU_: RESISTOR, European symbol Digikey Parts: Yageo, 0402 <https://www.digikey.com/products/en/resistors/chip-resistor-surface-mount/52?k=&pkeyword=&sv=0&s=4356&sf=1&FV=-1%7C13%2C7%7C2%2C1291%7C39157%2C1989%7C0%2C-8%7C52%2C3%7C1131%2C3%7C2503&quantity=&ColumnSort=0&page=1&stock=1&pageSize=25> Yageo, 0603 <https://www.digikey.com/products/en/resistors/chip-resistor-surface-mount/52?k=&pkeyword=&sv=0&pv1291=39245&sf=1&FV=-5%7C4356%2C-5%7C47360%2C-8%7C52%2C-1%7C13%2C7%7C2%2C1989%7C0&quantity=10&ColumnSort=1000011&page=1&stock=1&pageSize=25> Panasonic, 0603 <https://www.digikey.com/products/en/resistors/chip-resistor-surface-mount/52?k=&pkeyword=&pv252=68&sf=0&FV=ffec373d%2C1c0002%2C142c040c%2C1f140000%2Cffe00034%2C80002%2Cc0001&quantity=&ColumnSort=0&page=1&stock=1&pageSize=25> Panasonic, precision, 0603 <https://www.digikey.com/products/en/resistors/chip-resistor-surface-mount/52?FV=ffec4907%2Cfffc000a%2Cc0172%2C142c040c%2C1f140000%2Cffe00034%2C1c0002&quantity=100&ColumnSort=2085&page=1&stock=1&pageSize=25> Panasonic, 0805 <https://www.digikey.com/products/en/resistors/chip-resistor-surface-mount/52?k=&pkeyword=&pv3=1&sf=0&FV=ffec373d%2C1c0002%2C1f140000%2Cffe00034%2C142c040d&quantity=&ColumnSort=0&page=1&stock=1&pageSize=25> Rohm, current sense <https://www.digikey.com/products/en/resistors/chip-resistor-surface-mount/52?k=&pkeyword=&pv3=1&sf=0&FV=ffecb688%2C1f140000%2Cffe00034%2C1c0002&quantity=&ColumnSort=0&page=1&stock=1&pageSize=25> Vishay, pulse proof automotive <https://www.digikey.com/products/en/resistors/chip-resistor-surface-mount/52?k=&pkeyword=&pv7=2&sf=0&FV=ffec5d6b%2Cffe00034%2C1f140000&quantity=&ColumnSort=0&page=1&stock=1&pageSize=25>; DIGIKEY: YAG2969CT-ND; MF: Yageo; MPN: RC0402FR-07130KL; VALUE_PART: 130k
R58 = bschulz_passives:R-EU_: RESISTOR, European symbol Digikey Parts: Yageo, 0402 <https://www.digikey.com/products/en/resistors/chip-resistor-surface-mount/52?k=&pkeyword=&sv=0&s=4356&sf=1&FV=-1%7C13%2C7%7C2%2C1291%7C39157%2C1989%7C0%2C-8%7C52%2C3%7C1131%2C3%7C2503&quantity=&ColumnSort=0&page=1&stock=1&pageSize=25> Yageo, 0603 <https://www.digikey.com/products/en/resistors/chip-resistor-surface-mount/52?k=&pkeyword=&sv=0&pv1291=39245&sf=1&FV=-5%7C4356%2C-5%7C47360%2C-8%7C52%2C-1%7C13%2C7%7C2%2C1989%7C0&quantity=10&ColumnSort=1000011&page=1&stock=1&pageSize=25> Panasonic, 0603 <https://www.digikey.com/products/en/resistors/chip-resistor-surface-mount/52?k=&pkeyword=&pv252=68&sf=0&FV=ffec373d%2C1c0002%2C142c040c%2C1f140000%2Cffe00034%2C80002%2Cc0001&quantity=&ColumnSort=0&page=1&stock=1&pageSize=25> Panasonic, precision, 0603 <https://www.digikey.com/products/en/resistors/chip-resistor-surface-mount/52?FV=ffec4907%2Cfffc000a%2Cc0172%2C142c040c%2C1f140000%2Cffe00034%2C1c0002&quantity=100&ColumnSort=2085&page=1&stock=1&pageSize=25> Panasonic, 0805 <https://www.digikey.com/products/en/resistors/chip-resistor-surface-mount/52?k=&pkeyword=&pv3=1&sf=0&FV=ffec373d%2C1c0002%2C1f140000%2Cffe00034%2C142c040d&quantity=&ColumnSort=0&page=1&stock=1&pageSize=25> Rohm, current sense <https://www.digikey.com/products/en/resistors/chip-resistor-surface-mount/52?k=&pkeyword=&pv3=1&sf=0&FV=ffecb688%2C1f140000%2Cffe00034%2C1c0002&quantity=&ColumnSort=0&page=1&stock=1&pageSize=25> Vishay, pulse proof automotive <https://www.digikey.com/products/en/resistors/chip-resistor-surface-mount/52?k=&pkeyword=&pv7=2&sf=0&FV=ffec5d6b%2Cffe00034%2C1f140000&quantity=&ColumnSort=0&page=1&stock=1&pageSize=25>; DIGIKEY: 311-11.0KLRCT-ND; MF: Yageo; MPN: RC0402FR-0711KL; VALUE_PART: 11k
S1 S2 = bschulz:BUTTON: Genaric SPST Push button; DIGIKEY: CKN10504CT-ND; MF: C&K; MPN: PTS810 SJG 250 SMTR LFS
S3 = bschulz:SPDT: Genaric SPDT switch; DIGIKEY: 7103K2CWAV2BE-ND; MF: C&K; MPN: 7103K2CWAV2BE
SD1 = bschulz:MICROSD: Micro-SD / Transflash card holder with SPI pinout For the 3M # 2908-05WB-MG and/or 4UCON #19656 push-push type; DIGIKEY: WM12834CT-ND; MF: Molex; MPN: 5031821852
TP1 TP2 TP5-TP9 = bschulz:TESTPOINT: Test Point; DIGIKEY: DNP; MF: N/A; MPN: DNP
U1 U9 U28 = bschulz:FXMAR2102: FXMAR2102 - 2 Channel Bidirectional Voltage Level Translator for I2C Applications Characteristics: Vcc: 1.65 ~ 5.5V IQ: <5μA Output Current: 50mA Output Type: Open Drain/Push-Pull Operating Temperature: -40°C to 85°C Digikey: FXMAR2102UMX-F106CT-ND (UMLP) <https://www.digikey.com/en/products/detail/onsemi/FXMAR2102UMX-F106/5050715>; DIGIKEY: FXMAR2102UMX-F106CT-ND; DISP: FXMAR2102; MF: OnSemi; MPN: FXMAR2102UMX-F106
U2 = bschulz:VEML3328: VEML3328 - RGBCIR Color Sensor with I2C Interface Characteristics: VCC: 2.6~3.6V Operating Temperature: -40°C to 85°C Resolution: 16 Bit Digikey: 751-VEML3328CT-ND <https://www.digikey.com/en/products/detail/vishay-semiconductor-opto-division/VEML3328/10673129>; DIGIKEY: 751-VEML3328CT-ND; DISP: VEML3328; MF: Vishay; MPN: VEML3328
U3 = bschulz:MMC5633: MMC5633 - High Performance 3 Axis Magnetic Sensor (Compass) Characteristics: Vcc: 1.62~ 3.6V Range: ±30G Magnetic Resolution: 0.0625mG Magnetic Accuracy Accuracy: ±2mG (<1°) Operating Temperature: -40°C to 85°C Digikey: 1267-MMC5633NJLCT-ND <https://www.digikey.com/en/products/detail/memsic-inc/MMC5633NJL/12171925> 1649-1066-1-ND (SHT31) <https://www.digikey.com/product-detail/en/sensirion-ag/SHT31-DIS-F2.5KS/1649-1066-1-ND/6212137> 1649-1067-1-ND (SHT35) <https://www.digikey.com/product-detail/en/sensirion-ag/SHT35-DIS-F2.5KS/1649-1067-1-ND/6212138>; DIGIKEY: 1267-MMC5633NJLCT-ND; DISP: MMC5633; MF: Memsic; MPN: MMC5633NJL
U4 = bschulz:BMA456: BMA456 - 3-axis Digital Accelerometer (I2C) Characteristics: Vcc: 1.62V ~ 3.6V Acceleration Range: ±2g, ±4g, ±8g, ±16g Sensitivity: 16384 ~ 2048 LSB/g (±2g ~ ± 16g) Operating Temperature: -40°C to 85°C Digikey: 828-1075-1-ND <https://www.digikey.com/en/products/detail/bosch-sensortec/BMA456/7401315>; DIGIKEY: 828-1075-1-ND; DISP: BMA456; MF: Bosch; MPN: BMA456
U5 U6 = bschulz:PAC1934: PAC1934 - High Side Current/Power Monitor with I2C Interface and Accumulator Characteristics: Vcc: 2.7V ~ 5.5V Iq: 5uA (Sleep) 0.1μA (Power Down) Common Mode Range: 0V ~ 40V Operating Temperature: -40°C to 85°C Digikey: PAC1934T-I/JQCT-ND (QFN) <https://www.digikey.com/en/products/detail/microchip-technology/PAC1934T-I-JQ/9453134>; DIGIKEY: PAC1934T-I/JQCT-ND; MF: Microchip; MPN: PAC1934T-I/JQ
U7 = bschulz:SHT4*: SHT4x - Digital Humidity and Temperature Sensor Characteristics (for SHT35): Vcc: 1.08V ~ 3.6V Humidity Resolution: 0.01% RH Humidity Accuracy: ±1.5% RH Temperature Resolution: 0.01°C Temperature Accuracy: 0.1°C Operating Temperature: -40°C to 125°C Digikey: 1649-SHT40-AD1B-R3CT-ND (SHT40) <https://www.digikey.com/en/products/detail/sensirion-ag/SHT40-AD1B-R3/14322709> 1649-SHT41-AD1B-R2CT-ND (SHT41) <https://www.digikey.com/en/products/detail/sensirion-ag/SHT41-AD1B-R2/15296591>; DIGIKEY: 1649-SHT40-AD1B-R3CT-ND; DISP: SHT40; MF: Sensirion; MPN: SHT40-AD1B-R3
U8 = bschulz:SN74AUP1G08: SN74AUP1G08 - AND, 1 Element, 2 Input Characteristics: VCC: 0.8 ~ 3.6v IQ = 0.5μA Operating Temperature: -40°C to 85°C Digikey: 296-19075-1-ND (DCK) <https://www.digikey.com/product-detail/en/texas-instruments/SN74AUP1G08DCKR/296-19075-1-ND/864306> 296-18650-1-ND (DRL) <https://www.digikey.com/product-detail/en/texas-instruments/SN74AUP1G08DRLR/296-18650-1-ND/863418> 296-17366-1-ND (YZP) <https://www.digikey.com/product-detail/en/texas-instruments/SN74AUP1G08YZPR/296-17366-1-ND/691784>; DIGIKEY: 296-19075-1-ND; MF: TI; MPN: SN74AUP1G08DCKR
U10 = bschulz:SN74AUP3G34: SN74AUP3G34 - Logic Buffer Characteristics: VCC: 0.8~3.6V Operating Temperature: -40°C to 85°C Number of Gates: 3 /li> Inverting: No Digikey: 296-27503-1-ND (UQFN, RSE) <https://www.digikey.com/scripts/DkSearch/dksus.dll?Detail&itemSeq=257211059&uq=636588853324239862> 296-36973-1-ND (XFDFN, DQE) <https://www.digikey.com/product-detail/en/texas-instruments/SN74AUP3G34DQER/296-36973-1-ND/4428921> 296-25595-1-ND (VFSOP, DCU) <https://www.digikey.com/product-detail/en/texas-instruments/SN74AUP3G34DCUR/296-25595-1-ND/2202056>; DIGIKEY: 296-25595-1-ND; MF: TI; MPN: SN74AUP3G34DCUR
U11 U30 = bschulz:TCK11*: TCK11x - Load Switch, with Reverse Current Blocking, Output Discharge (TCK112G Only) Characteristics: Vin: 1.1v ~ 5.5v IQ: <0.5μA (OFF), 48μA (ON) RDS(ON): 8.4mΩ (Vin = 3.3v) Output Current: 3A, max Operating Temperature: -40°C to 85°C Digikey: TCK111GLFCT-ND (TCK111G) <https://www.digikey.com/en/products/detail/toshiba-semiconductor-and-storage/TCK111G-LF/4948988> TCK112GLFCT-ND (TCK112G) <https://www.digikey.com/en/products/detail/toshiba-semiconductor-and-storage/TCK112G-LF/4880051?s=N4IgTCBcDaICoGEDSBGFYDiIC6BfIA>; DIGIKEY: TCK111GLFCT-ND; DISP: TCK111G; MF: Toshiba; MPN: TCK111G,LF
U12 = bschulz:LTC4412: LTC4412 - Low Loss PowerPath Controller (ORing FET Controller) Characteristics: Vin: 2.5V ~ 28V IQ: 11μA typ Operating Temperature: -40°C to 125°C Digikey: LTC4412ES6#TRPBFCT-ND <https://www.digikey.com/product-detail/en/linear-technology-analog-devices/LTC4412ES6-TRPBF/LTC4412ES6-TRPBFCT-ND/4694482>; DIGIKEY: LTC4412ES6#TRPBFCT-ND; MF: LT; MPN: LTC4412ES6#TRPBF
U13 = bschulz:TPS7A03*: TPS7A03* - Ultra Low Power Low Dropout Linear Regulator Characteristics: Vin: 1.5V ~ 6V Vout: 0.8 ~ 5V fixed intervals IQ: 25nA typ, 3nA shutdown Voltage Accuracy: 1.5% Output Current: 200 mA Operating Temperature: -40°C to 125°C Digikey: TPS7A0331PDQNR (3.1V Fixed, X2SON) <https://www.digikey.com/en/products/detail/texas-instruments/TPS7A0331PDQNR/11625396>; DIGIKEY: 296-TPS7A0331PDQNRCT-ND; DISP: TPS7A0331; MF: TI; MPN: TPS7A0331PDQNR
U14 = bschulz:LP5907: LP5907 - Ultra Low Noise, Low IQ LDO Characteristics: Vin: 2.2V ~ 5.5V Vout: 1.8V ~ 4.5V fixed IQ: 12μA typ VDO: 120mV typ at 250mA Voltage Accuracy: ±2% Output Current: 250 mA PSRR: 82 dB at 1kHz Operating Temperature: -40°C to 125°C Digikey: 296-38557-1-ND (3.3V Fixed) <https://www.digikey.com/en/products/detail/texas-instruments/LP5907MFX-3-3-NOPB/3906441> 296-40356-1-ND (2.5V Fixed) <https://www.digikey.com/en/products/detail/texas-instruments/LP5907MFX-2-5-NOPB/5019039>; DIGIKEY: 296-39067-1-ND; DISP: LP5907; MF: TI; MPN: LP5907UVX-3.3/NOPB
U15 = bschulz:MIC2260*: MIC2260x - High Efficiency Synchronous Buck Converter Characteristics: Vin: 2.6V ~ 5.5V Vout: 0.7V ~ Vin Output Current (max): 6A IQ: 850μA (typ) Operating Temperature: -40°C to 85°C Digikey: 576-3645-1-ND <https://www.digikey.com/en/products/detail/microchip-technology/MIC22602YML-TR/2242451>; DIGIKEY: 576-3645-1-ND; DISP: MIC22602; MF: Microchip; MPN: MIC22602YML-TR
U16 = bschulz:BQ25616: BQ25616 - Buck Battery Charger Standalone 1-Cell 3.0-A Buck Battery Charger with Power Path and 1.2-A Boost Operation Characteristics: Vin: 4V ~ 13.5V Vbat, Max: 4.35V ICharge, max: 3A IQ: 9.5μA Operating Temperature: -40°C to 85°C Digikey: 296-BQ25616RTWRCT-ND <https://www.digikey.com/en/products/detail/BQ25616RTWR/296-BQ25616RTWRCT-ND/11615905?itemSeq=348322194>; DIGIKEY: 296-BQ25616RTWRCT-ND; MF: TI; MPN: BQ25616RTWR
U17 = bschulz:TPS6128*: TPS6128x - Low/Wide Voltage Battery Front-End DC/DC Converter, Logic Interface Characteristics: Vin: 2.3V ~ 4.8V Output Current: >4A Peak IQ: 3μA (typ), 20μA (max) Operating Temperature: -40°C to 85°C Digikey: TPS61282DYFFT <https://www.digikey.com/en/products/detail/texas-instruments/TPS61282DYFFT/9696885> TPS61281YFFT <https://www.digikey.com/en/products/detail/texas-instruments/TPS61281YFFT/4489150>; DIGIKEY: 296-50826-1-ND; DISP: TPS61282D; MF: TI; MPN: TPS61282DYFFT
U18 U19 = bschulz:PCAL95*5A: PCAL95*5A - I2C I/O Expander, 16 bit wtih interrupt and agile IO Characteristics: Vcc: 1.65V ~ 5.5V IOut: 25 mA IQ: 1μA Operating Temperature: -40°C to 85°C Internal Configurable Pullups/Pulldown* Digikey: 568-9947-1-ND (PCAL9535A, QFN) <https://www.digikey.com/en/products/detail/nxp-usa-inc/PCAL9535AHF-128/3721166> 568-9952-1-ND (PCAL9555A, QFN) <https://www.digikey.com/en/products/detail/nxp-usa-inc/PCAL9555AHF-128/3598045> *PCAL9555A has pullups enabled by default, but remain configurable; DIGIKEY: 568-9947-1-ND; DISP: PCAL9535A; MF: NXP; MPN: PCAL9535AHF,128
U20 = bschulz:MAX-M8*: MAX-M8* GPS Unit - GNSS Module Characteristics: VCC: 2.7~3.6V Operating Temperature: -40°C to 85°C Digikey: 672-MAX-M8W-0CT-ND (MAX-M8W) <https://www.digikey.com/en/products/detail/MAX-M8W-0/672-MAX-M8W-0CT-ND/6150667?itemSeq=371005764>; DIGIKEY: 672-MAX-M8W-0CT-ND; DISP: MAX-M8W; MF: U-Blox; MPN: MAX-M8W-0
U21 = bschulz:MCP794*: MCP794xx - Battery Backed I2C Real Time Clock (RTC) with SRAM (EEPROM*) and Protected EERPOM Characteristics: VCC: 1.8~5.5V VBat: 1.3~5.5V IQ: 1.2μA @ 3.3V Vcc, 925nA @ 3.0V VBat Memory: 64B, 64B Protected EEPROM, 1kB EEPROM* Interface: I2C Operating Temperature: -40°C to 85°C *Only on MCP7941x models Digikey: MCP79411, SOIC (MCP79411T-I/SNCT-ND) <https://www.digikey.com/en/products/detail/microchip-technology/MCP79411T-I-SN/2533083> MCP79412, SOIC (MCP79412-I/SN-ND) <https://www.digikey.com/en/products/detail/microchip-technology/MCP79412-I-SN/2712450> Pin Compatible Alternatives <https://www.digikey.com/products/en/integrated-circuits-ics/clock-timing-real-time-clocks/690?FV=401994%2C26802e4%2C45003ef%2C450041e%2C4500072%2C450050c%2C4500565%2C450057c%2C450057e%2C4500010%2C4500011%2C4500017%2C450017d%2C4500180%2C450004f%2C1f140000%2Cffe002b2%2C16980015%2C1698001a%2C1698001d%2C16980026%2C16980027%2C16980029%2C16980036%2C16980009&quantity=10&ColumnSort=1000011&page=2&stock=1&nstock=1&pageSize=25> Note: These are recomendations at the time, always verify pin compatability using combination of Mrk1 EyeBall and quality datasheet; DIGIKEY: MCP79412-I/SN-ND; DISP: MCP79412; MF: Microchip; MPN: MCP79412-I/SN
U22 = bschulz:HALL_EFFECT: General Hall Effect Sensor; DIGIKEY: 336-4121-1-ND; DISP: Si7201; MF: Silicon Labs; MPN: SI7201-B-05-IVR
U23 = bschulz:PCA9634: PCA9634 - I2C LED Driver, 8 Channel Characteristics: Vcc: 2.3V ~ 5.5V IOut: >25mA IQ: 2.9μA @ 3.3V PWM Resolution: 256 Steps Operating Temperature: -40°C to 85°C Digikey: 568-8717-1-ND (QFN) <https://www.digikey.com/en/products/detail/nxp-usa-inc/PCA9634BS-118/1300982>; DIGIKEY: 568-8717-1-ND; DISP: PCA9634; MF: NXP; MPN: PCA9634BS,118
U24 = bschulz:SN74LVC1G17: SN74LVC1G17 - Single Schmitt Trigger Logic Buffer Characteristics: VCC: 1.65~5.5V Operating Temperature: -40°C to 125°C Number of Gates: 1 /li> Inverting: No 5V Tolerent Input (Down Shift) Digikey: 296-11934-1-ND (SC70, DCK) <https://www.digikey.com/product-detail/en/texas-instruments/SN74LVC1G17DCKR/296-11934-1-ND/389052>; DIGIKEY: 296-11934-1-ND; DISP: SN74LVC1G17; MF: TI; MPN: SN74LVC1G17DCKR
U25 U26 = bschulz:TPL5010: TPL5010 - Nano-Power System Timer with Watchdog Functionality Characteristics: Vdd: 1.8V ~ 5.5V IQ: 35nA (typ) Period: 100ms ~ 7200 s Operating Temperature: -40°C to 85°C Digikey: 296-38829-1-ND <https://www.digikey.com/product-detail/en/texas-instruments/TPL5010DDCT/296-38829-1-ND/5130149>; DIGIKEY: 296-38829-1-ND; MF: TI; MPN: TPL5010DDCT
U27 = bschulz:MB85RC*: MB85RCx - FRAM I2C Memory Characteristics: Vin: 1.8 ~ 3.6V IQ: 15μA typ ISleep: 4μA Capacity: 64kb, 512kb, 1Mb Operating Temperature: -40°C to 85°C Digikey: 865-1269-1-ND <https://www.digikey.com/en/products/detail/fujitsu-semiconductor/MB85RC512TPNF-G-JNERE1/5456435>; DIGIKEY: 865-1269-1-ND; DISP: MB85RC512; MF: Fujitsu; MPN: MB85RC512TPNF-G-JNERE1
U29 = bschulz:SIT1552: SiT1552 - Ultra Low Power 32.768 kHz MEMS TCXO Characteristics: Vin: 1.5~3.63V IQ: <1μA Frequency Stability: ±5, ±10, ±20 ppm Operating Temperature: -40°C to 125°C Digikey: 1473-1242-1-ND (±10ppm) <https://www.digikey.com/en/products/detail/sitime/SIT1552AI-JF-DCC-32-768D/5035515>; DIGIKEY: 1473-1242-1-ND; DISP: SiT1552; MF: SiTime; MPN: SIT1552AI-JF-DCC-32.768D
U31 = bschulz:FPF219*: FPF219x - Load Switch, with Adjustable Current Limit and Fault Indicator Characteristics: Vin: 1.8v ~ 5.5v IQ: <2μA (OFF), 75μA (ON) RDS(ON): 55mΩ (Vin = 3.3v) Output Current: 1.5A (Max, limit adj) Operating Temperature: -40°C to 85°C Digikey: FPF2195BUCXCT-ND (FPF2195BUCX) <https://www.digikey.com/en/products/detail/onsemi/FPF2195BUCX/4562742>; DIGIKEY: FPF2195BUCXCT-ND; DISP: FPF2195BUCX; MF: onsemi; MPN: FPF2195BUCX
U32 = bschulz:SN74*1G14: SN74x1G14 - Single Schmitt Triger Inverter Characteristics: VCC: AUP: 0.8 ~ 3.6V LVC: 1.65 ~ 5.5V Operating Temperature: -40°C to 85°C (-40°C to 125°C for LVC Version) fmax = 2.5 MHz (for Vcc =1.65v, high for higher Vcc) Output Current = ± 4 mA (± 32 mA for LVC Version) Digikey: 296-19076-1-ND (AUP Low Voltage, SC-70) <https://www.digikey.com/product-detail/en/texas-instruments/SN74AUP1G14DCKR/296-19076-1-ND/864307> 296-47215-1-ND (LVC High Voltage, SC-70) <https://www.digikey.com/product-detail/en/texas-instruments/SN74LVC1G14DCKR/296-11608-1-ND/385747>; DIGIKEY: 296-11608-1-ND; DISP: SN74LVC1G14; MF: TI; MPN: SN74LVC1G14DCKR
U33 = bschulz:TPS7A02*: TPS7A02* - Ultra Low Power Low Dropout Linear Regulator Characteristics: Vin: 1.5V ~ 6V Vout: 0.8 ~ 5V fixed intervals IQ: 25nA typ, 3nA shutdown Voltage Accuracy: 1.5% Output Current: 200 mA Operating Temperature: -40°C to 125°C Digikey: TPS7A0218PDQ (1.8V Fixed, X2SON) <https://www.digikey.com/en/products/detail/texas-instruments/TPS7A0218PDQNR/11502185> TPS7A0518PDB (1.8V Fixed, SOT23) <https://www.digikey.com/en/products/detail/texas-instruments/TPS7A0218PDBVR/12165211>; DIGIKEY: 296-TPS7A0218PDQNRCT-ND; DISP: TPS7A0218PDQ; MF: TI; MPN: TPS7A0218PDQNR
USB1 = bschulz:USB_MICRO: General Micro USB - AB Connector; DIGIKEY: MUSBK15230-ND; MF: Amphenol; MPN: MUSBK15230

## Module TALON
Ports: 3V3(pwr) RX(io) TX(io) SEL(in) EN(in) !FAULT(out) SDA(in) SCL(io) GND(pwr) I2C_EN(in) I2C_EN_GLOBAL(in) GPIOB(io) GPIOA(io)
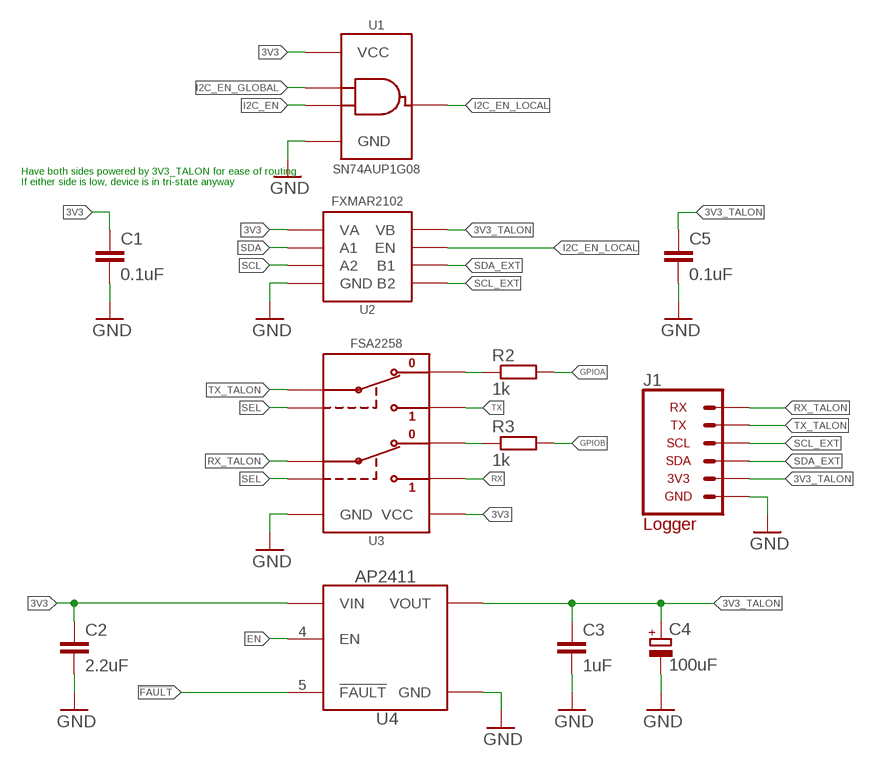
[diagram p6: schematic, module TALON, sheet 1]

### Parts
C1  0.1uF  C-EU0.1UFC0402  [C0402]
C2  2.2uF  C-EU2.2UFC0603  [C0603]
C3  1uF  C-EU1UFC0603  [C0603]
C4  100uF  CTANT_EU1411  [C1411_TANT]
C5  0.1uF  C-EU0.1UFC0402  [C0402]
J1  CONN_TALON_LOGGER  [1X06_MICROLOCKPLUS_RT]
R2  1k  R-EU_1KR0402  [R0402]
R3  1k  R-EU_1KR0402  [R0402]
U1  SN74AUP1G08DCK  [DCK_R-PDSO-G5]
U2  FXMAR2102UMLP  [UQFN-8_1.4X1.2]
U3  FSA2258  [MICROPAK_10]
U4  AP2411  [MSOP_8EP]

### Nets
3V3: C1.1 C2.1 U1.5(VCC) U2.1(VA) U3.10(VCC) U4.2(VIN) U4.3(VIN)
3V3_TALON: C3.1 C4.ANODE(+) C5.1 J1.2(3V3) U2.8(VB) U4.6(VOUT) U4.7(VOUT)
!FAULT: U4.5(!FAULT)
EN: U4.4(EN)
GND: C1.2 C2.2 C3.2 C4.CATHODE(-) C5.2 J1.1(GND) U1.3(GND) U2.4(GND) U3.5(GND) U4.1(GND) U4.EP(GND)
GPIOA: R2.2
GPIOB: R3.2
I2C_EN: U1.2(B)
I2C_EN_GLOBAL: U1.1(A)
I2C_EN_LOCAL: U1.4(Y) U2.5(EN)
N$1: R2.1 U3.1(1B0)
N$2: R3.1 U3.3(2B0)
RX: U3.4(2B1)
RX_TALON: J1.6(RX) U3.6(2A)
SCL: U2.3(A2)
SCL_EXT: J1.4(SCL) U2.6(B2)
SDA: U2.2(A1)
SDA_EXT: J1.3(SDA) U2.7(B1)
SEL: U3.7(S2) U3.8(S1)
TX: U3.2(1B1)
TX_TALON: J1.5(TX) U3.9(1A)

### Notes on the sheet
- Have both sides powered by 3V3_TALON for ease of routing
  If either side is low, device is in tri-state anyway

### Library data of the parts
C1 C5 = bschulz_passives:C-EU: CAPACITOR, European symbol; DIGIKEY: 490-4759-1-ND; MF: Murata; MPN: GCM155R71C104KA55D
C2 = bschulz_passives:C-EU: CAPACITOR, European symbol; DIGIKEY: 1276-1183-1-ND; MF: Samsung; MPN: CL10A225KQ8NNNC
C3 = bschulz_passives:C-EU: CAPACITOR, European symbol; DIGIKEY: 587-2984-1-ND; MF: Yaiyo Yuden; MPN: TMK107B7105KA-T
C4 = bschulz_passives:CTANT_EU: Genaric Tantalum Capacitor; DIGIKEY: 478-5231-1-ND; MF: Kyocera AVX; MPN: TPSB107M010R0400
J1 = GEMS_Plugs:CONN_TALON: GEMS Connector for Talon Interface; DIGIKEY: WM22471CT-ND; DISP: Logger; MF: Molex; MPN: 5055670681
R2 R3 = bschulz_passives:R-EU_: RESISTOR, European symbol Digikey Parts: Yageo, 0402 <https://www.digikey.com/products/en/resistors/chip-resistor-surface-mount/52?k=&pkeyword=&sv=0&s=4356&sf=1&FV=-1%7C13%2C7%7C2%2C1291%7C39157%2C1989%7C0%2C-8%7C52%2C3%7C1131%2C3%7C2503&quantity=&ColumnSort=0&page=1&stock=1&pageSize=25> Yageo, 0603 <https://www.digikey.com/products/en/resistors/chip-resistor-surface-mount/52?k=&pkeyword=&sv=0&pv1291=39245&sf=1&FV=-5%7C4356%2C-5%7C47360%2C-8%7C52%2C-1%7C13%2C7%7C2%2C1989%7C0&quantity=10&ColumnSort=1000011&page=1&stock=1&pageSize=25> Panasonic, 0603 <https://www.digikey.com/products/en/resistors/chip-resistor-surface-mount/52?k=&pkeyword=&pv252=68&sf=0&FV=ffec373d%2C1c0002%2C142c040c%2C1f140000%2Cffe00034%2C80002%2Cc0001&quantity=&ColumnSort=0&page=1&stock=1&pageSize=25> Panasonic, precision, 0603 <https://www.digikey.com/products/en/resistors/chip-resistor-surface-mount/52?FV=ffec4907%2Cfffc000a%2Cc0172%2C142c040c%2C1f140000%2Cffe00034%2C1c0002&quantity=100&ColumnSort=2085&page=1&stock=1&pageSize=25> Panasonic, 0805 <https://www.digikey.com/products/en/resistors/chip-resistor-surface-mount/52?k=&pkeyword=&pv3=1&sf=0&FV=ffec373d%2C1c0002%2C1f140000%2Cffe00034%2C142c040d&quantity=&ColumnSort=0&page=1&stock=1&pageSize=25> Rohm, current sense <https://www.digikey.com/products/en/resistors/chip-resistor-surface-mount/52?k=&pkeyword=&pv3=1&sf=0&FV=ffecb688%2C1f140000%2Cffe00034%2C1c0002&quantity=&ColumnSort=0&page=1&stock=1&pageSize=25> Vishay, pulse proof automotive <https://www.digikey.com/products/en/resistors/chip-resistor-surface-mount/52?k=&pkeyword=&pv7=2&sf=0&FV=ffec5d6b%2Cffe00034%2C1f140000&quantity=&ColumnSort=0&page=1&stock=1&pageSize=25>; DIGIKEY: 311-1.00KLRCT-ND; MF: Yageo; MPN: RC0402FR-071KL; VALUE_PART: 1k
U1 = bschulz:SN74AUP1G08: SN74AUP1G08 - AND, 1 Element, 2 Input Characteristics: VCC: 0.8 ~ 3.6v IQ = 0.5μA Operating Temperature: -40°C to 85°C Digikey: 296-19075-1-ND (DCK) <https://www.digikey.com/product-detail/en/texas-instruments/SN74AUP1G08DCKR/296-19075-1-ND/864306> 296-18650-1-ND (DRL) <https://www.digikey.com/product-detail/en/texas-instruments/SN74AUP1G08DRLR/296-18650-1-ND/863418> 296-17366-1-ND (YZP) <https://www.digikey.com/product-detail/en/texas-instruments/SN74AUP1G08YZPR/296-17366-1-ND/691784>; DIGIKEY: 296-19075-1-ND; MF: TI; MPN: SN74AUP1G08DCKR
U2 = bschulz:FXMAR2102: FXMAR2102 - 2 Channel Bidirectional Voltage Level Translator for I2C Applications Characteristics: Vcc: 1.65 ~ 5.5V IQ: <5μA Output Current: 50mA Output Type: Open Drain/Push-Pull Operating Temperature: -40°C to 85°C Digikey: FXMAR2102UMX-F106CT-ND (UMLP) <https://www.digikey.com/en/products/detail/onsemi/FXMAR2102UMX-F106/5050715>; DIGIKEY: FXMAR2102UMX-F106CT-ND; DISP: FXMAR2102; MF: OnSemi; MPN: FXMAR2102UMX-F106
U3 = bschulz:FSA2258: FSA2258 - Low Voltage, Dual SPDT Analog Switch Characteristics: VCC: 1.65~4.3V On state resistace: 0.8 Ω, Max Channel to Channel Matching: 0.2 Ω, Typical Operating Temperature: -40°C to 85°C Digikey: FSA2258L10XCT-ND <https://www.digikey.com/en/products/detail/onsemi/FSA2258L10X/2115881>; DIGIKEY: FSA2258L10XCT-ND; DISP: FSA2258; MF: OnSemi; MPN: FSA2258L10X
U4 = bschulz:AP24*1: AP24x1 - Current Limit Load Switch with Latch-Off Characteristics: Vin: 2.7V ~ 5.5V IQ: 0.1μA (OFF), 60μA (ON) RDS(ON): 70mΩ (Vin = 5V), 90mΩ (Vin = 3.3V) UVLO: 2V Output Current: 2.5A Operating Temperature: -40°C to 85°C Digikey: AP2411MP-13DICT-ND (MSOP, Active High) <https://www.digikey.com/en/products/detail/diodes-incorporated/AP2411MP-13/2755849>; DIGIKEY: AP2411MP-13DICT-ND; DISP: AP2411; MF: Diodes Inc; MPN: AP2411MP-13